# EAGLE design PitchshiftDelay-Control-v1.2 (EAGLE 9.1.3)

## Sheet 1 of 4
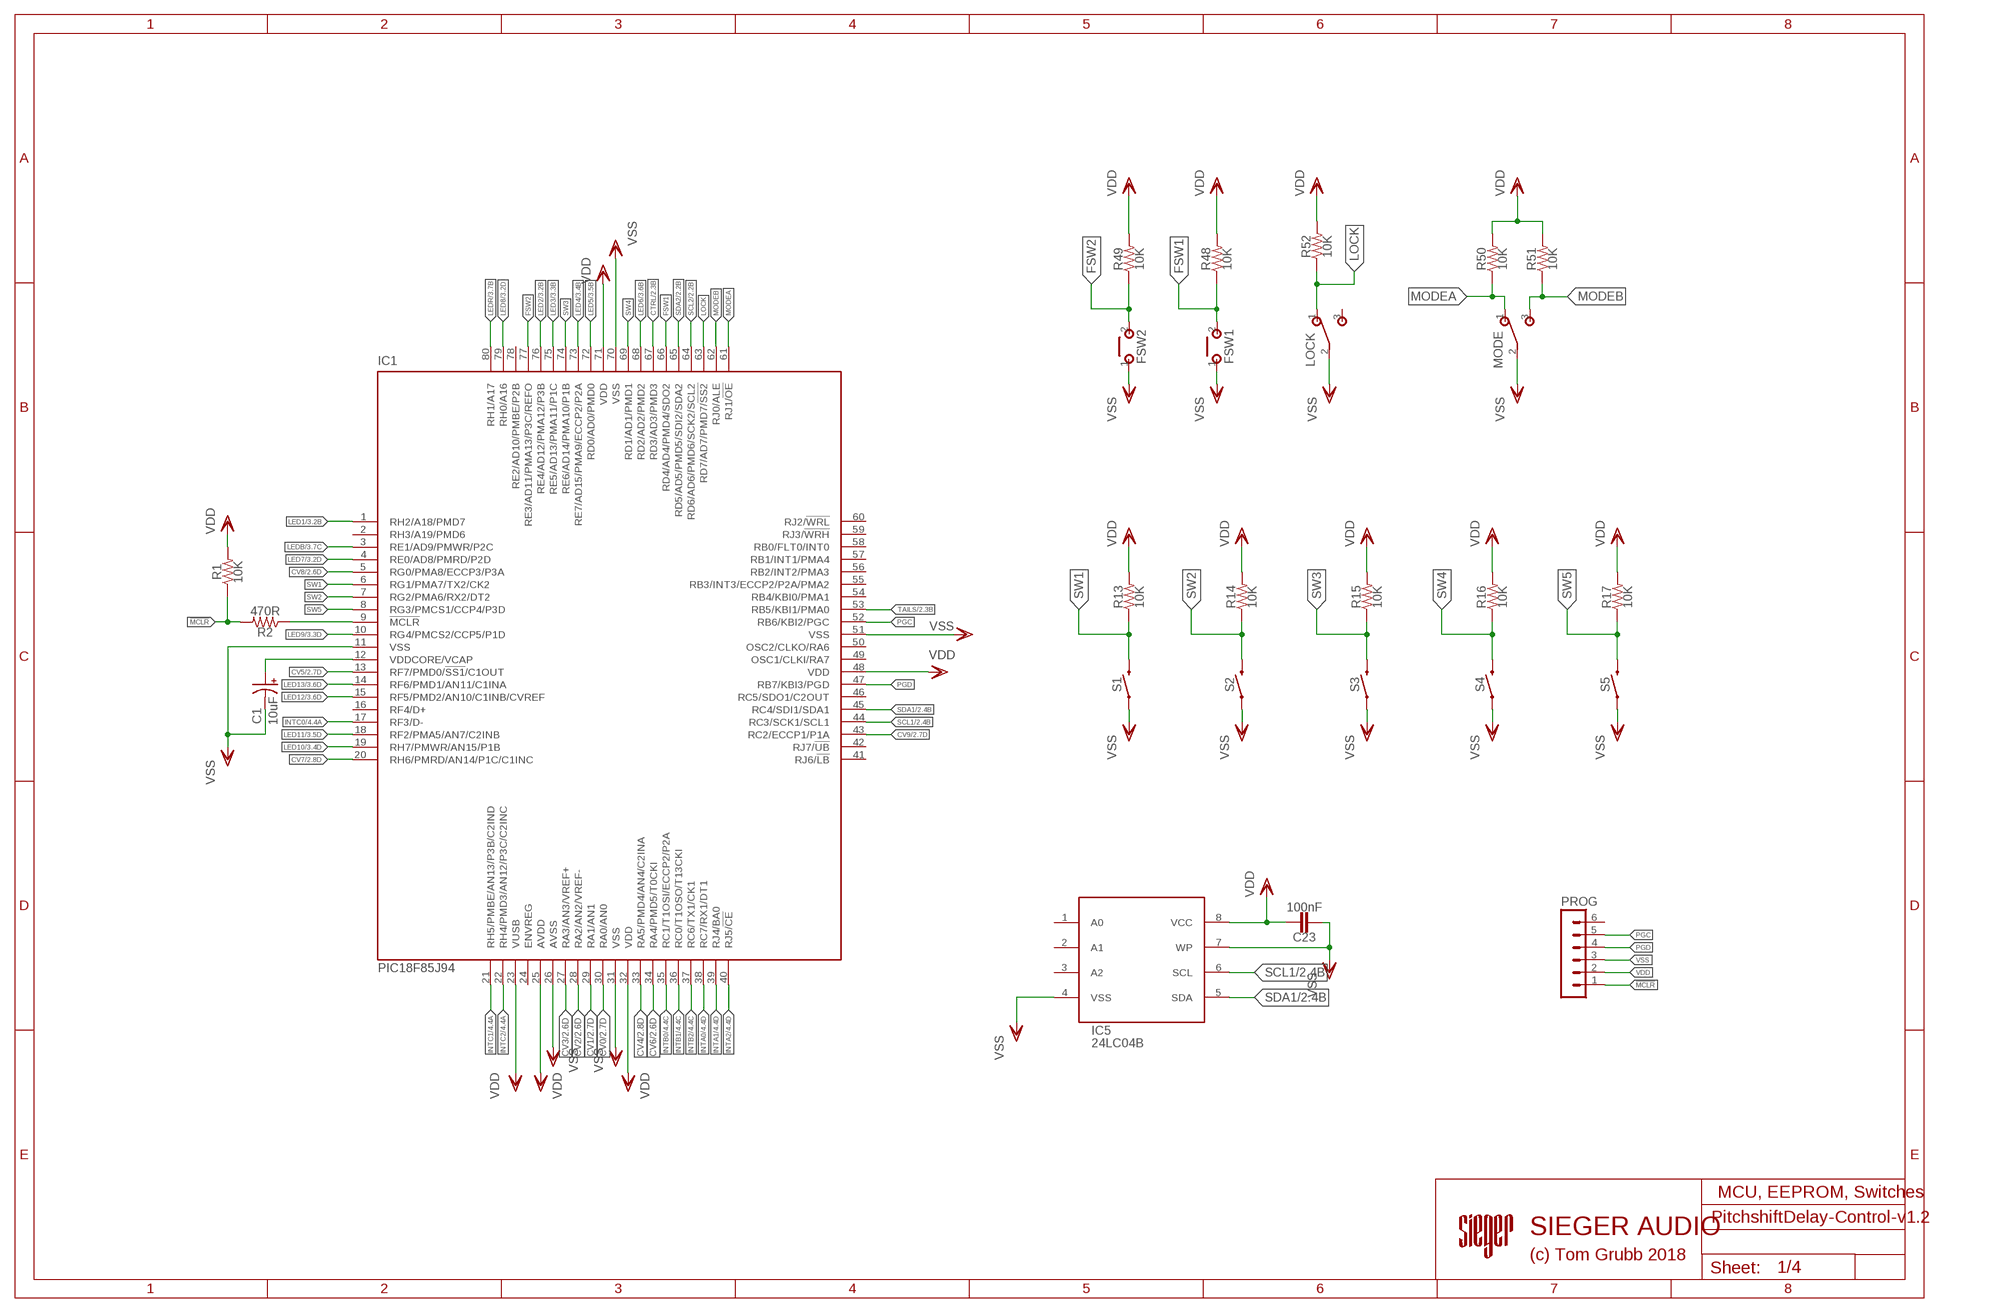
[diagram p0: schematic, sheet 1]

### Parts
C1  10uF  0501  [050_020_1]
C23  100nF  CER/FILM1  [050X030_025]
FSW1  MOMENTARY  [SPST]
FSW2  MOMENTARY  [SPST]
IC1  PIC18F85J94  PIC18F85J50  [TQFP80-12X12]
IC5  24LC04B  [SOIC8]
LOCK  SPDTPIN_MOUNT  [1MS1T1B1C0M2QE]
MODE  SPDTPIN_MOUNT  [1MS1T1B1C0M2QE]
PROG  MA06-1  [MA06-1]
R1  10K  RESISTOR0805  [RESISTOR_C0805]
R2  470R  RESISTOR0805  [RESISTOR_C0805]
R13  10K  RESISTOR0805  [RESISTOR_C0805]
R14  10K  RESISTOR0805  [RESISTOR_C0805]
R15  10K  RESISTOR0805  [RESISTOR_C0805]
R16  10K  RESISTOR0805  [RESISTOR_C0805]
R17  10K  RESISTOR0805  [RESISTOR_C0805]
R48  10K  RESISTOR0805  [RESISTOR_C0805]
R49  10K  RESISTOR0805  [RESISTOR_C0805]
R50  10K  RESISTOR0805  [RESISTOR_C0805]
R51  10K  RESISTOR0805  [RESISTOR_C0805]
R52  10K  RESISTOR0805  [RESISTOR_C0805]
S1  MOMENTARY-SWITCH-SPST-PTH-6.0MM  [TACTILE_SWITCH_PTH_6.0MM]
S2  MOMENTARY-SWITCH-SPST-PTH-6.0MM  [TACTILE_SWITCH_PTH_6.0MM]
S3  MOMENTARY-SWITCH-SPST-PTH-6.0MM  [TACTILE_SWITCH_PTH_6.0MM]
S4  MOMENTARY-SWITCH-SPST-PTH-6.0MM  [TACTILE_SWITCH_PTH_6.0MM]
S5  MOMENTARY-SWITCH-SPST-PTH-6.0MM  [TACTILE_SWITCH_PTH_6.0MM]

### Nets
!MCLR: PROG.1 R1.1 R2.2
CTRL: IC1.67(RD3/AD3/PMD3) ; also sheet 2
CV0: IC1.30(RA0/AN0) ; also sheet 2,4
CV1: IC1.29(RA1/AN1) ; also sheet 2,4
CV2: IC1.28(RA2/AN2/VREF-) ; also sheet 2,4
CV3: IC1.27(RA3/AN3/VREF+) ; also sheet 2,4
CV4: IC1.33(RA5/PMD4/AN4/C2INA) ; also sheet 2,4
CV5: IC1.13(RF7/PMD0/!SS1!/C1OUT) ; also sheet 2,4
CV6: IC1.34(RA4/PMD5/T0CKI) ; also sheet 2,4
CV7: IC1.20(RH6/PMRD/AN14/P1C/C1INC) ; also sheet 2,4
CV8: IC1.5(RG0/PMA8/ECCP3/P3A) ; also sheet 2,4
CV9: IC1.43(RC2/ECCP1/P1A) ; also sheet 2,4
FSW1: FSW1.2(S) IC1.66(RD4/AD4/PMD4/SDO2) R48.1
FSW2: FSW2.2(S) IC1.77(RE3/AD11/PMA13/P3C/REFO) R49.1
INTA0: IC1.38(RC7/RX1/DT1) ; also sheet 4
INTA1: IC1.39(RJ4/BA0) ; also sheet 4
INTA2: IC1.40(RJ5/!CE) ; also sheet 4
INTB0: IC1.35(RC1/T1OSI/ECCP2/P2A) ; also sheet 4
INTB1: IC1.36(RC0/T1OSO/T13CKI) ; also sheet 4
INTB2: IC1.37(RC6/TX1/CK1) ; also sheet 4
INTC0: IC1.17(RF3/D-) ; also sheet 4
INTC1: IC1.21(RH5/PMBE/AN13/P3B/C2IND) ; also sheet 4
INTC2: IC1.22(RH4/PMD3/AN12/P3C/C2INC) ; also sheet 4
LED1: IC1.1(RH2/A18/PMD7) ; also sheet 3
LED2: IC1.76(RE4/AD12/PMA12/P3B) ; also sheet 3
LED3: IC1.75(RE5/AD13/PMA11/P1C) ; also sheet 3
LED4: IC1.73(RE7/AD15/PMA9/ECCP2/P2A) ; also sheet 3
LED5: IC1.72(RD0/AD0/PMD0) ; also sheet 3
LED6: IC1.68(RD2/AD2/PMD2) ; also sheet 3
LED7: IC1.4(RE0/AD8/PMRD/P2D) ; also sheet 3
LED8: IC1.79(RH0/A16) ; also sheet 3
LED9: IC1.10(RG4/PMCS2/CCP5/P1D) ; also sheet 3
LED10: IC1.19(RH7/PMWR/AN15/P1B) ; also sheet 3
LED11: IC1.18(RF2/PMA5/AN7/C2INB) ; also sheet 3
LED12: IC1.15(RF5/PMD2/AN10/C1INB/CVREF) ; also sheet 3
LED13: IC1.14(RF6/PMD1/AN11/C1INA) ; also sheet 3
LEDB: IC1.3(RE1/AD9/PMWR/P2C) ; also sheet 3
LEDR: IC1.80(RH1/A17) ; also sheet 3
LOCK: IC1.63(RD7/AD7/PMD7/!SS2) LOCK.1(O) R52.1
MODEA: IC1.61(RJ1/!OE) MODE.1(O) R50.1
MODEB: IC1.62(RJ0/ALE) MODE.3(S) R51.1
N$1: C1.+ IC1.12(VDDCORE/VCAP)
N$71: IC1.9(!MCLR) R2.1
PGC: IC1.52(RB6/KBI2/PGC) PROG.5
PGD: IC1.47(RB7/KBI3/PGD) PROG.4
SCL1: IC1.44(RC3/SCK1/SCL1) IC5.6(SCL) ; also sheet 2
SCL2: IC1.64(RD6/AD6/PMD6/SCK2/SCL2) ; also sheet 2
SDA1: IC1.45(RC4/SDI1/SDA1) IC5.5(SDA) ; also sheet 2
SDA2: IC1.65(RD5/AD5/PMD5/SDI2/SDA2) ; also sheet 2
SW1: IC1.6(RG1/PMA7/TX2/CK2) R13.1 S1.3
SW2: IC1.7(RG2/PMA6/RX2/DT2) R14.1 S2.3
SW3: IC1.74(RE6/AD14/PMA10/P1B) R15.1 S3.3
SW4: IC1.69(RD1/AD1/PMD1) R16.1 S4.3
SW5: IC1.8(RG3/PMCS1/CCP4/P3D) R17.1 S5.3
TAILS: IC1.53(RB5/KBI1/PMA0) ; also sheet 2
VDD: C23.1 IC1.23(VUSB) IC1.25(AVDD) IC1.32(VDD) IC1.48(VDD) IC1.71(VDD) IC5.8(VCC) PROG.2 R1.2 R13.2 R14.2 R15.2 R16.2 R17.2 R48.2 R49.2 R50.2 R51.2 R52.2 ; also sheet 2,3,4
VSS: C1.- C23.2 FSW1.1(P) FSW2.1(P) IC1.11(VSS) IC1.26(AVSS) IC1.31(VSS) IC1.51(VSS) IC1.70(VSS) IC5.4(VSS) IC5.7(WP) LOCK.2(P) MODE.2(P) PROG.3 S1.1 S2.1 S3.1 S4.1 S5.1 ; also sheet 2,3,4
Unconnected: IC1.2(RH3/A19/PMD6) IC1.16(RF4/D+) IC1.24(ENVREG) IC1.41(RJ6/!LB) IC1.42(RJ7/!UB) IC1.46(RC5/SDO1/C2OUT) IC1.49(OSC1/CLKI/RA7) IC1.50(OSC2/CLKO/RA6) IC1.54(RB4/KBI0/PMA1) IC1.55(RB3/INT3/ECCP2/P2A/PMA2) IC1.56(RB2/INT2/PMA3) IC1.57(RB1/INT1/PMA4) IC1.58(RB0/FLT0/INT0) IC1.59(RJ3/!WRH) IC1.60(RJ2/!WRL) IC1.78(RE2/AD10/PMBE/P2B) IC5.1(A0) IC5.2(A1) IC5.3(A2) LOCK.3(S) PROG.6

### Notes on the sheet
- MCU, EEPROM, Switches
- SIEGER AUDIO
- (c) Tom Grubb 2018

## Sheet 2 of 4
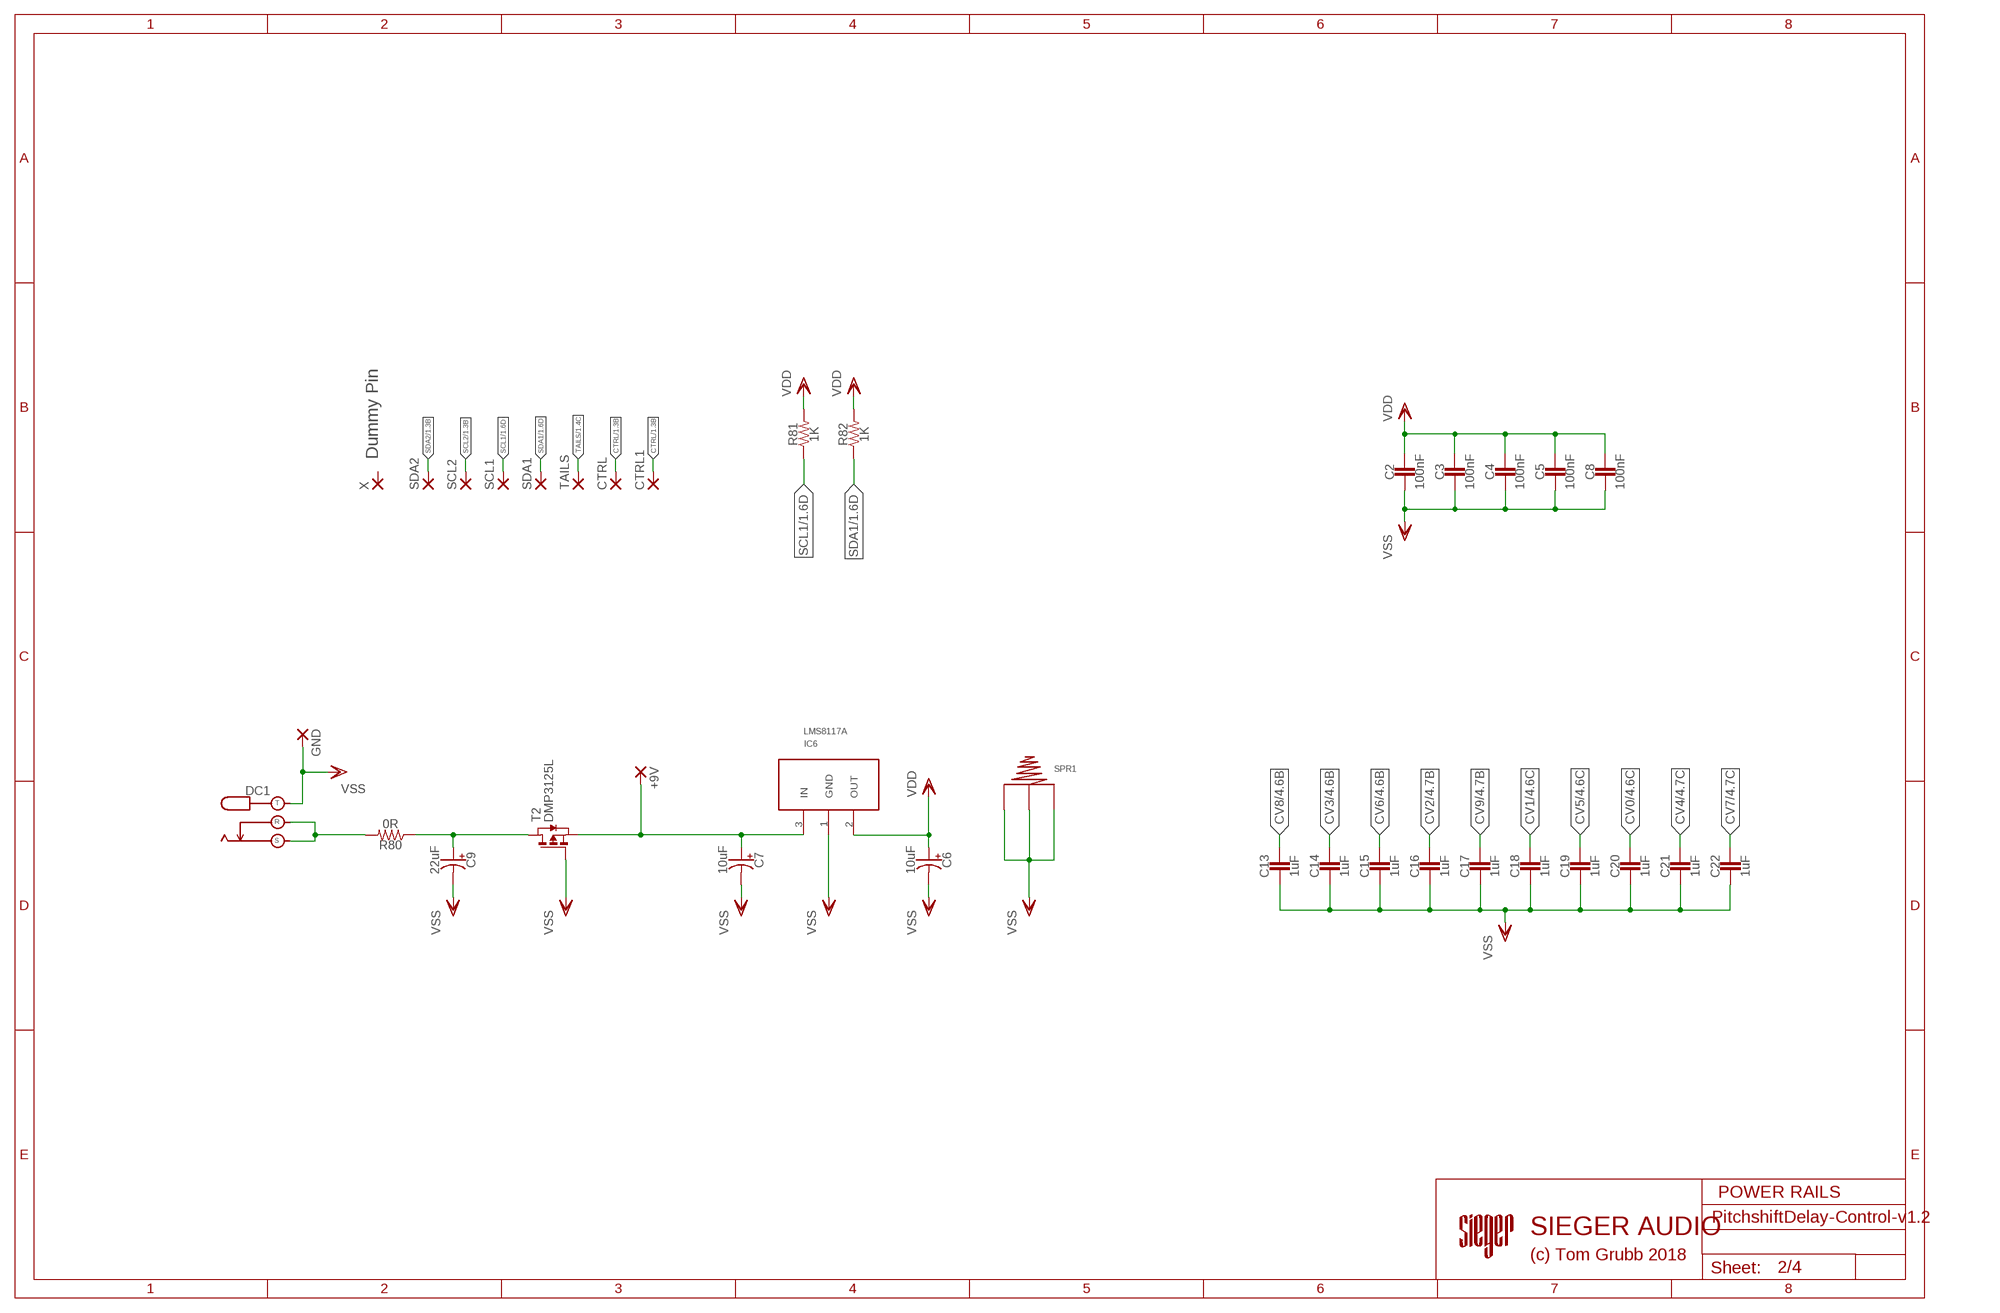
[diagram p1: schematic, sheet 2]

### Parts
+9V  2,15/1,0  [2,15/1,0]
C2  100nF  CER/FILM1  [050X030_025]
C3  100nF  CER/FILM1  [050X030_025]
C4  100nF  CER/FILM1  [050X030_025]
C5  100nF  CER/FILM1  [050X030_025]
C6  10uF  0501  [050_020_1]
C7  10uF  0501  [050_020_1]
C8  100nF  CER/FILM1  [050X030_025]
C9  22uF  0501  [050_020_1]
C13  1uF  CER/FILM1  [050X030_025]
C14  1uF  CER/FILM1  [050X030_025]
C15  1uF  CER/FILM1  [050X030_025]
C16  1uF  CER/FILM1  [050X030_025]
C17  1uF  CER/FILM1  [050X030_025]
C18  1uF  CER/FILM1  [050X030_025]
C19  1uF  CER/FILM1  [050X030_025]
C20  1uF  CER/FILM1  [050X030_025]
C21  1uF  CER/FILM1  [050X030_025]
C22  1uF  CER/FILM1  [050X030_025]
CTRL  2,15/1,0  [2,15/1,0]
CTRL1  2,15/1,0  [2,15/1,0]
DC1  DC_KOBICONN  [DC_KOBICONN]
GND  2,15/1,0  [2,15/1,0]
IC6  LMS8117A  [SOT223]
R80  0R  RESISTOR0805  [RESISTOR_C0805]
R81  1K  RESISTOR0805  [RESISTOR_C0805]
R82  1K  RESISTOR0805  [RESISTOR_C0805]
SCL1  2,15/1,0  [2,15/1,0]
SCL2  2,15/1,0  [2,15/1,0]
SDA1  2,15/1,0  [2,15/1,0]
SDA2  2,15/1,0  [2,15/1,0]
SPR1  534-628  SPRING  ['A'SIZE-PC-SPRING]
T2  DMP3125L  PMOSSOT23  [SOT-23]
TAILS  2,15/1,0  [2,15/1,0]
X  2,15/1,0  [2,15/1,0]

### Nets
9V: +9V.1(P) C7.+ IC6.3(IN) T2.2(S)
CTRL: CTRL1.1(P) CTRL.1(P) ; also sheet 1
CV0: C20.1 ; also sheet 1,4
CV1: C18.1 ; also sheet 1,4
CV2: C16.1 ; also sheet 1,4
CV3: C14.1 ; also sheet 1,4
CV4: C21.1 ; also sheet 1,4
CV5: C19.1 ; also sheet 1,4
CV6: C15.1 ; also sheet 1,4
CV7: C22.1 ; also sheet 1,4
CV8: C13.1 ; also sheet 1,4
CV9: C17.1 ; also sheet 1,4
SCL1: R81.1 SCL1.1(P) ; also sheet 1
SCL2: SCL2.1(P) ; also sheet 1
SDA1: R82.1 SDA1.1(P) ; also sheet 1
SDA2: SDA2.1(P) ; also sheet 1
TAILS: TAILS.1(P) ; also sheet 1
VDD: C2.1 C3.1 C4.1 C5.1 C6.+ C8.1 IC6.2(OUT) R81.2 R82.2 ; also sheet 1,3,4
VIN: DC1.R DC1.S R80.2
VINF: C9.+ R80.1 T2.1(D)
VSS: C2.2 C3.2 C4.2 C5.2 C6.- C7.- C8.2 C9.- C13.2 C14.2 C15.2 C16.2 C17.2 C18.2 C19.2 C20.2 C21.2 C22.2 DC1.T GND.1(P) IC6.1(GND) SPR1.P$1 SPR1.P$2 SPR1.P$3 T2.3(G) ; also sheet 1,3,4
Unconnected: X.1(P)

### Notes on the sheet
- Dummy Pin
- POWER RAILS
- SIEGER AUDIO
- (c) Tom Grubb 2018

## Sheet 3 of 4
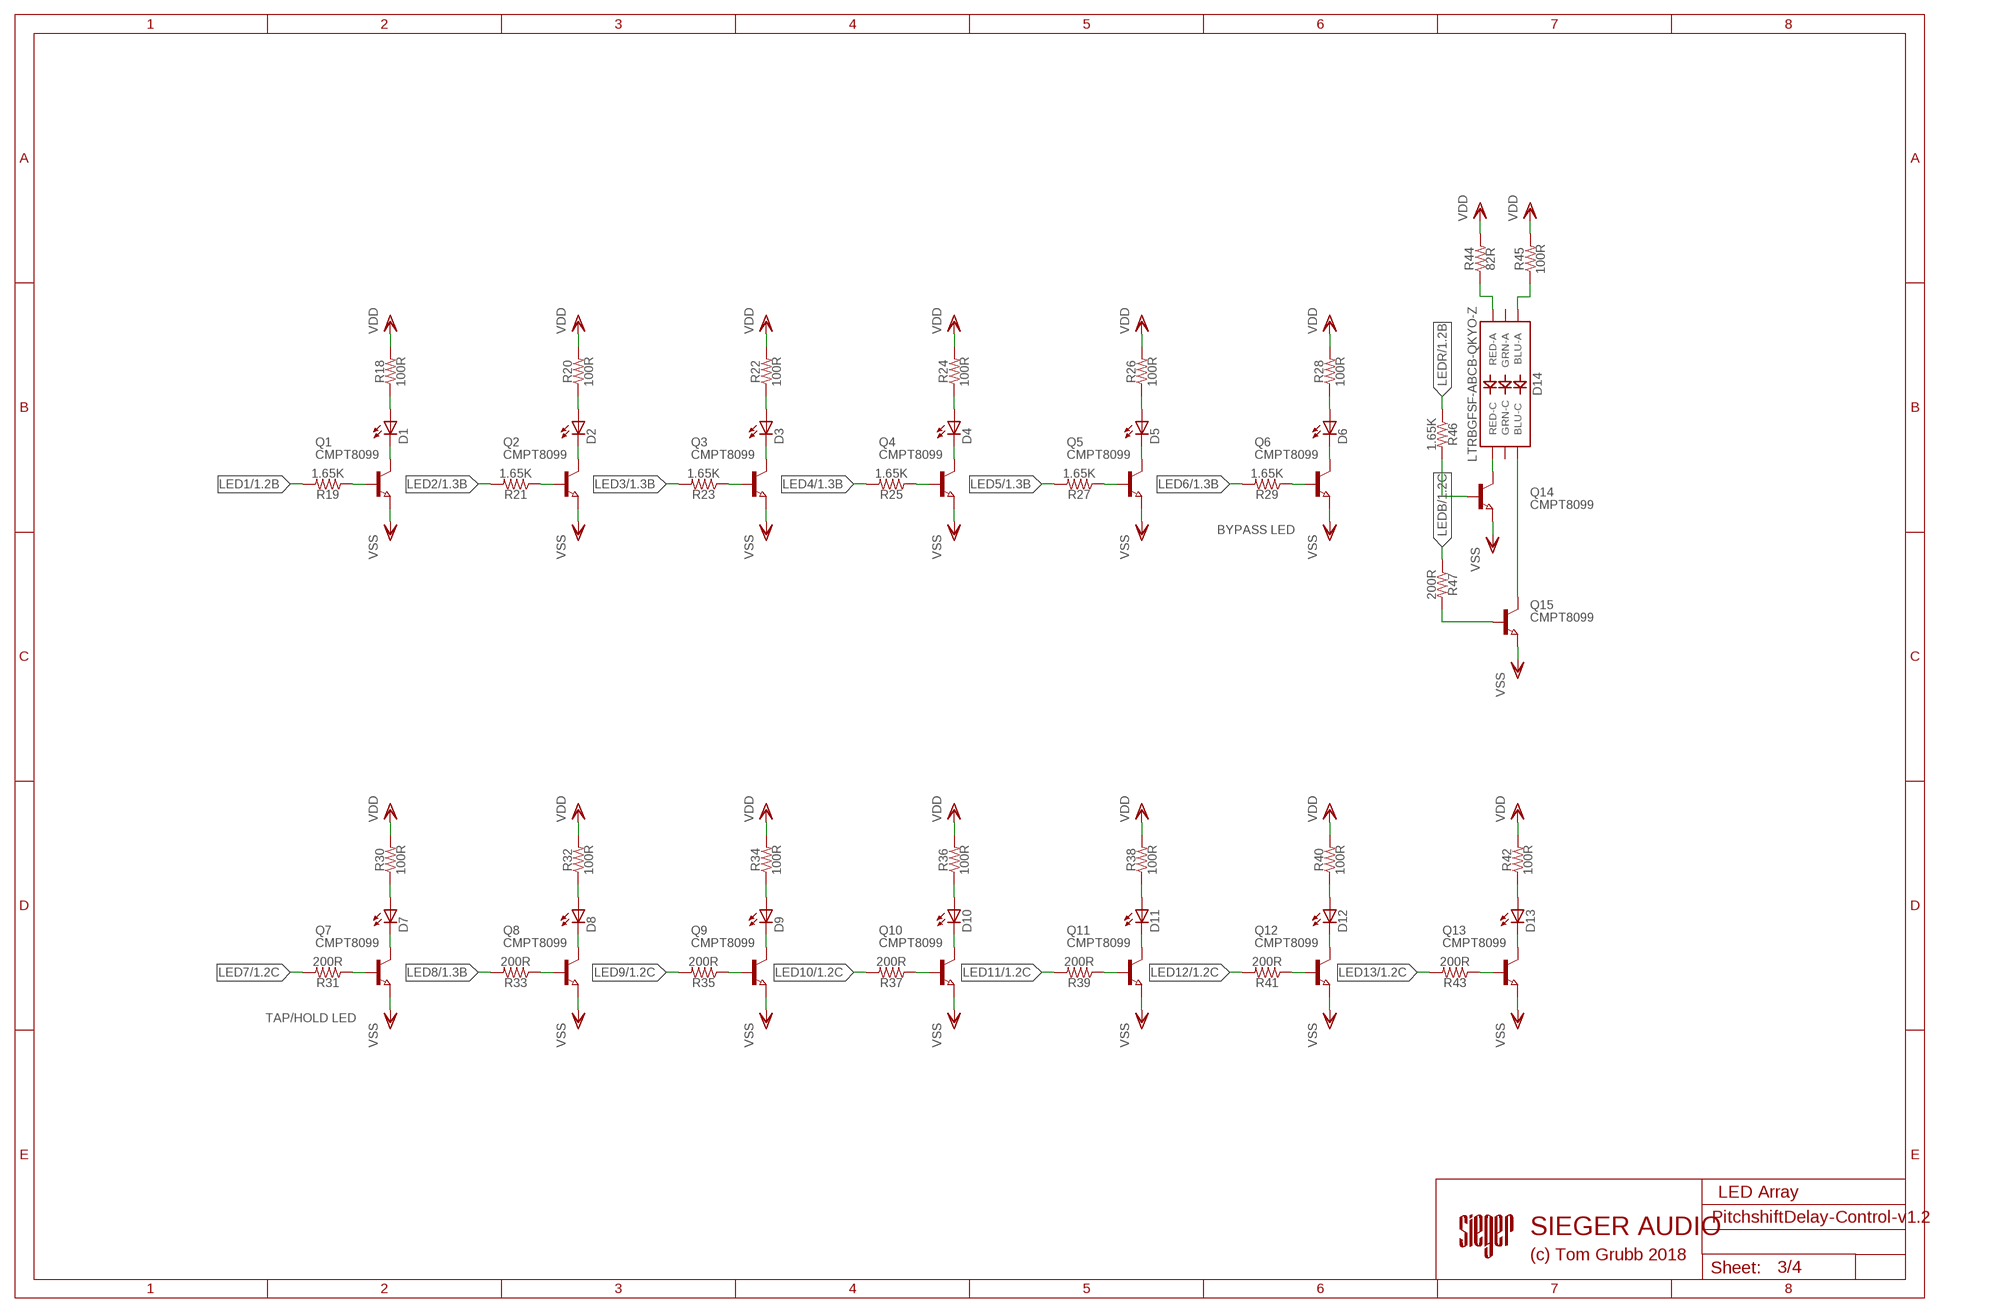
[diagram p2: schematic, sheet 3]

### Parts
D1  LEDCHIP-LED0805  [CHIP-LED0805]
D2  LEDCHIP-LED0805  [CHIP-LED0805]
D3  LEDCHIP-LED0805  [CHIP-LED0805]
D4  LEDCHIP-LED0805  [CHIP-LED0805]
D5  LEDCHIP-LED0805  [CHIP-LED0805]
D6  LEDCHIPLED_1206  [CHIPLED_1206]
D7  LEDCHIPLED_1206  [CHIPLED_1206]
D8  LEDCHIP-LED0805  [CHIP-LED0805]
D9  LEDCHIP-LED0805  [CHIP-LED0805]
D10  LEDCHIP-LED0805  [CHIP-LED0805]
D11  LEDCHIP-LED0805  [CHIP-LED0805]
D12  LEDCHIP-LED0805  [CHIP-LED0805]
D13  LEDCHIP-LED0805  [CHIP-LED0805]
D14  LTRBGFSF-ABCB-QKYO-Z  LED-RGBPLCC-6  [PLCC-6-LED]
Q1  CMPT8099  NPN-TRANSISTOR_SOT23  [SOT23]
Q2  CMPT8099  NPN-TRANSISTOR_SOT23  [SOT23]
Q3  CMPT8099  NPN-TRANSISTOR_SOT23  [SOT23]
Q4  CMPT8099  NPN-TRANSISTOR_SOT23  [SOT23]
Q5  CMPT8099  NPN-TRANSISTOR_SOT23  [SOT23]
Q6  CMPT8099  NPN-TRANSISTOR_SOT23  [SOT23]
Q7  CMPT8099  NPN-TRANSISTOR_SOT23  [SOT23]
Q8  CMPT8099  NPN-TRANSISTOR_SOT23  [SOT23]
Q9  CMPT8099  NPN-TRANSISTOR_SOT23  [SOT23]
Q10  CMPT8099  NPN-TRANSISTOR_SOT23  [SOT23]
Q11  CMPT8099  NPN-TRANSISTOR_SOT23  [SOT23]
Q12  CMPT8099  NPN-TRANSISTOR_SOT23  [SOT23]
Q13  CMPT8099  NPN-TRANSISTOR_SOT23  [SOT23]
Q14  CMPT8099  NPN-TRANSISTOR_SOT23  [SOT23]
Q15  CMPT8099  NPN-TRANSISTOR_SOT23  [SOT23]
R18  100R  RESISTOR0805  [RESISTOR_C0805]
R19  1.65K  RESISTOR0805  [RESISTOR_C0805]
R20  100R  RESISTOR0805  [RESISTOR_C0805]
R21  1.65K  RESISTOR0805  [RESISTOR_C0805]
R22  100R  RESISTOR0805  [RESISTOR_C0805]
R23  1.65K  RESISTOR0805  [RESISTOR_C0805]
R24  100R  RESISTOR0805  [RESISTOR_C0805]
R25  1.65K  RESISTOR0805  [RESISTOR_C0805]
R26  100R  RESISTOR0805  [RESISTOR_C0805]
R27  1.65K  RESISTOR0805  [RESISTOR_C0805]
R28  100R  RESISTOR0805  [RESISTOR_C0805]
R29  1.65K  RESISTOR0805  [RESISTOR_C0805]
R30  100R  RESISTOR0805  [RESISTOR_C0805]
R31  200R  RESISTOR0805  [RESISTOR_C0805]
R32  100R  RESISTOR0805  [RESISTOR_C0805]
R33  200R  RESISTOR0805  [RESISTOR_C0805]
R34  100R  RESISTOR0805  [RESISTOR_C0805]
R35  200R  RESISTOR0805  [RESISTOR_C0805]
R36  100R  RESISTOR0805  [RESISTOR_C0805]
R37  200R  RESISTOR0805  [RESISTOR_C0805]
R38  100R  RESISTOR0805  [RESISTOR_C0805]
R39  200R  RESISTOR0805  [RESISTOR_C0805]
R40  100R  RESISTOR0805  [RESISTOR_C0805]
R41  200R  RESISTOR0805  [RESISTOR_C0805]
R42  100R  RESISTOR0805  [RESISTOR_C0805]
R43  200R  RESISTOR0805  [RESISTOR_C0805]
R44  82R  RESISTOR0805  [RESISTOR_C0805]
R45  100R  RESISTOR0805  [RESISTOR_C0805]
R46  1.65K  RESISTOR0805  [RESISTOR_C0805]
R47  200R  RESISTOR0805  [RESISTOR_C0805]

### Nets
LED1: R19.2 ; also sheet 1
LED2: R21.2 ; also sheet 1
LED3: R23.2 ; also sheet 1
LED4: R25.2 ; also sheet 1
LED5: R27.2 ; also sheet 1
LED6: R29.2 ; also sheet 1
LED7: R31.2 ; also sheet 1
LED8: R33.2 ; also sheet 1
LED9: R35.2 ; also sheet 1
LED10: R37.2 ; also sheet 1
LED11: R39.2 ; also sheet 1
LED12: R41.2 ; also sheet 1
LED13: R43.2 ; also sheet 1
LEDB: R47.1 ; also sheet 1
LEDR: R46.1 ; also sheet 1
N$12: D1.C Q1.3(C)
N$13: D1.A R18.1
N$14: Q2.1(B) R21.1
N$15: D2.C Q2.3(C)
N$16: D2.A R20.1
N$17: Q1.1(B) R19.1
N$18: Q3.1(B) R23.1
N$19: D3.C Q3.3(C)
N$20: D3.A R22.1
N$21: Q4.1(B) R25.1
N$22: D4.C Q4.3(C)
N$23: D4.A R24.1
N$24: Q5.1(B) R27.1
N$25: D5.C Q5.3(C)
N$26: D5.A R26.1
N$27: Q6.1(B) R29.1
N$28: D6.C Q6.3(C)
N$29: D6.A R28.1
N$30: Q7.1(B) R31.1
N$31: D7.C Q7.3(C)
N$32: D7.A R30.1
N$33: Q8.1(B) R33.1
N$34: D8.C Q8.3(C)
N$35: D8.A R32.1
N$36: Q9.1(B) R35.1
N$37: D9.C Q9.3(C)
N$38: D9.A R34.1
N$39: Q10.1(B) R37.1
N$40: D10.C Q10.3(C)
N$41: D10.A R36.1
N$42: Q11.1(B) R39.1
N$43: D11.C Q11.3(C)
N$44: D11.A R38.1
N$45: Q12.1(B) R41.1
N$46: D12.C Q12.3(C)
N$47: D12.A R40.1
N$48: Q13.1(B) R43.1
N$49: D13.C Q13.3(C)
N$50: D13.A R42.1
N$51: D14.AR(RED-A) R44.1
N$52: D14.AB(BLU-A) R45.1
N$53: D14.CR(RED-C) Q14.3(C)
N$54: D14.CB(BLU-C) Q15.3(C)
N$56: Q14.1(B) R46.2
N$58: Q15.1(B) R47.2
VDD: R18.2 R20.2 R22.2 R24.2 R26.2 R28.2 R30.2 R32.2 R34.2 R36.2 R38.2 R40.2 R42.2 R44.2 R45.2 ; also sheet 1,2,4
VSS: Q1.2(E) Q2.2(E) Q3.2(E) Q4.2(E) Q5.2(E) Q6.2(E) Q7.2(E) Q8.2(E) Q9.2(E) Q10.2(E) Q11.2(E) Q12.2(E) Q13.2(E) Q14.2(E) Q15.2(E) ; also sheet 1,2,4
Unconnected: D14.AG(GRN-A) D14.CG(GRN-C)

### Notes on the sheet
- BYPASS LED
- TAP/HOLD LED
- LED Array
- SIEGER AUDIO
- (c) Tom Grubb 2018

## Sheet 4 of 4
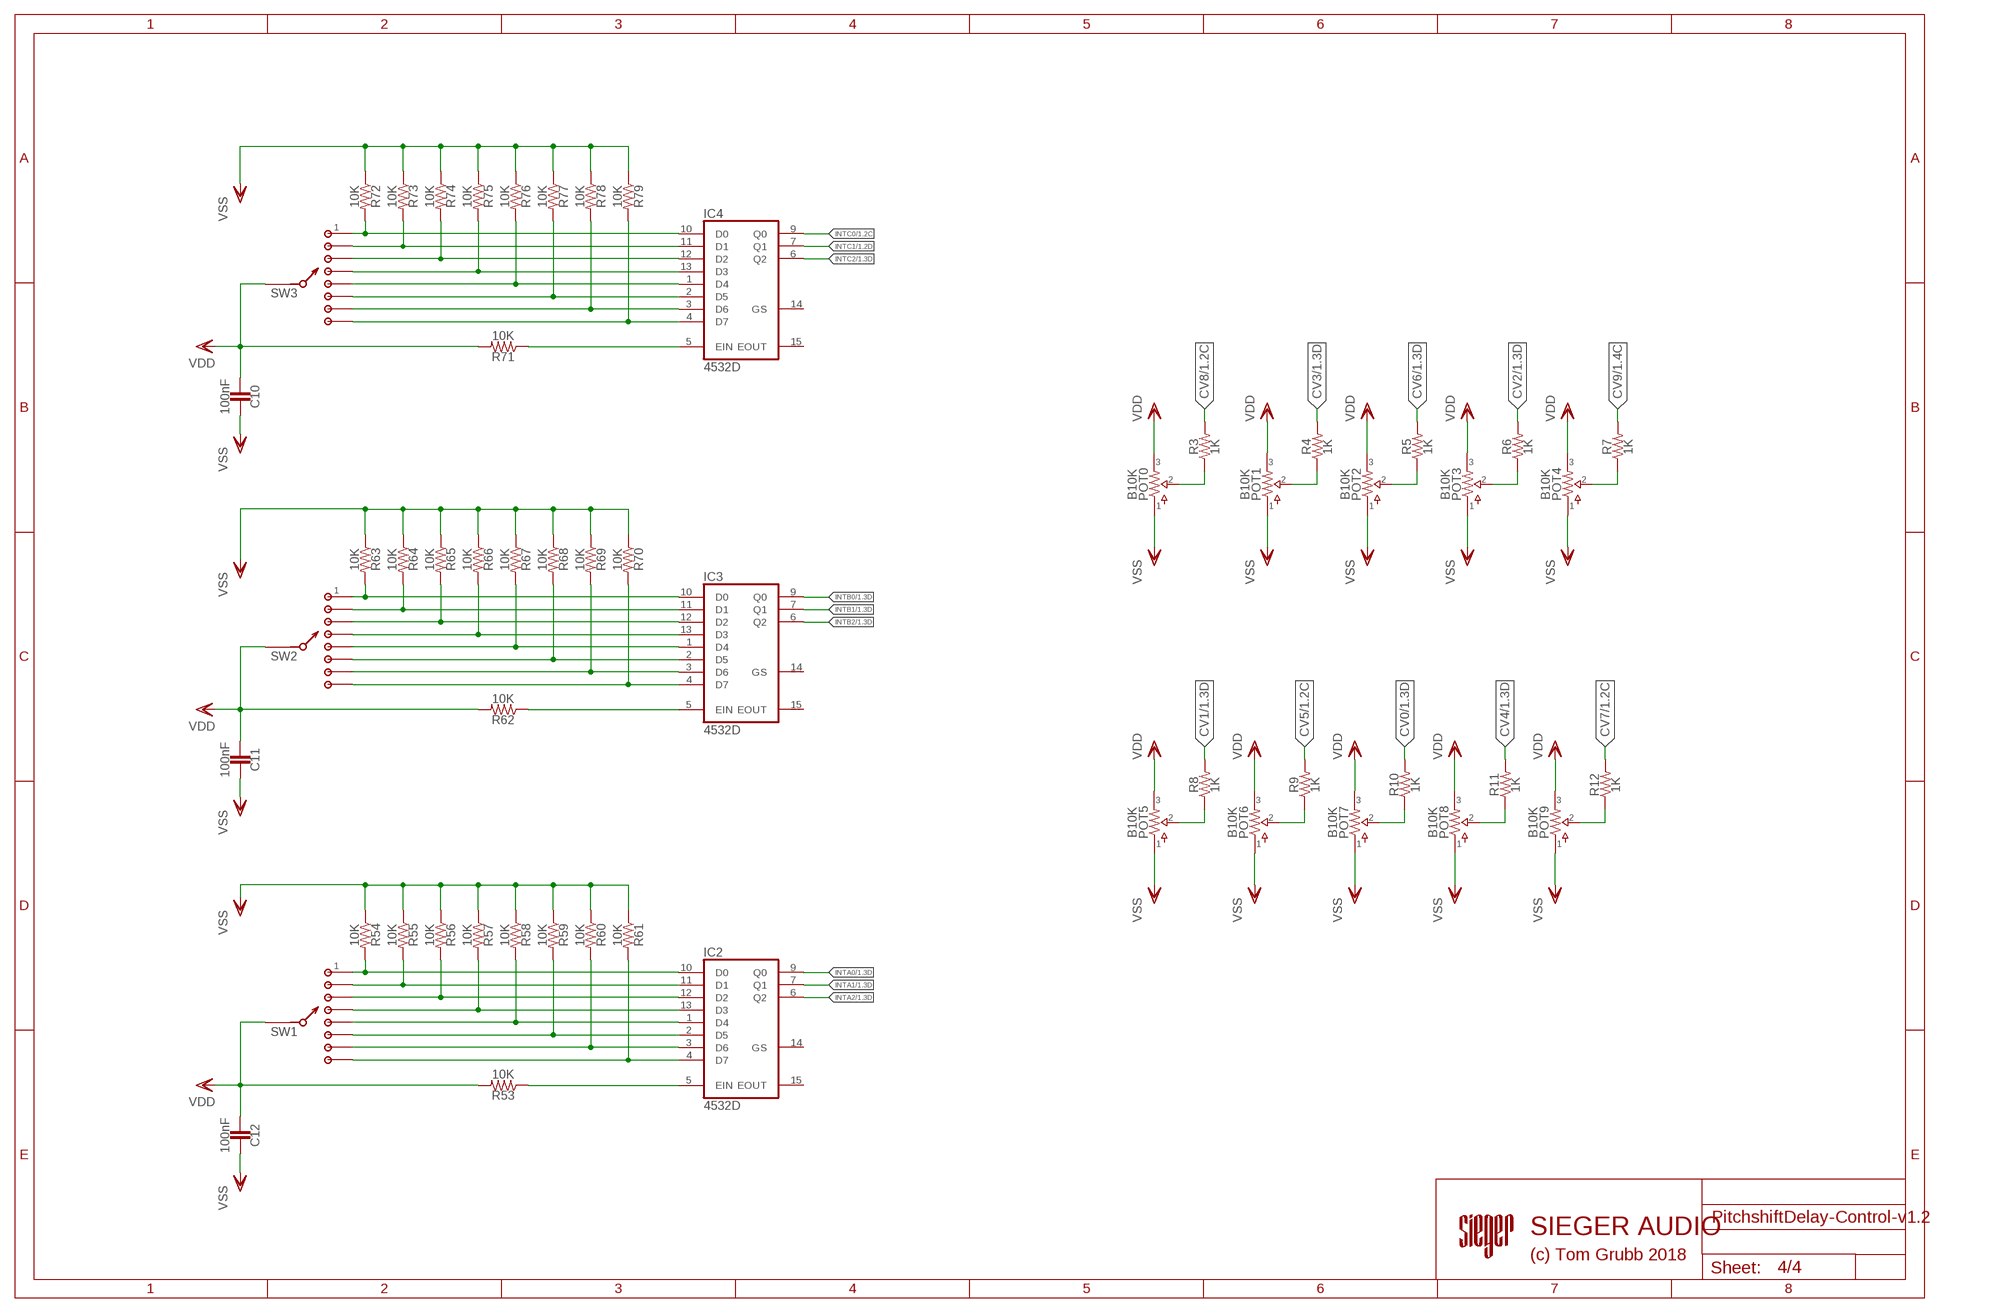
[diagram p3: schematic, sheet 4]

### Parts
C10  100nF  CER/FILM1  [050X030_025]
C11  100nF  CER/FILM1  [050X030_025]
C12  100nF  CER/FILM1  [050X030_025]
IC2  4532D  [SO16]
IC3  4532D  [SO16]
IC4  4532D  [SO16]
POT0  B10K  POTS9MM_MOUNTED_2MMH  [9MM_W/MOUNTS-2MMHOLES]
POT1  B10K  POTS9MM_MOUNTED_2MMH  [9MM_W/MOUNTS-2MMHOLES]
POT2  B10K  POTS9MM_MOUNTED_2MMH  [9MM_W/MOUNTS-2MMHOLES]
POT3  B10K  POTS9MM_MOUNTED_2MMH  [9MM_W/MOUNTS-2MMHOLES]
POT4  B10K  POTS9MM_MOUNTED_2MMH  [9MM_W/MOUNTS-2MMHOLES]
POT5  B10K  POTS9MM_MOUNTED_2MMH  [9MM_W/MOUNTS-2MMHOLES]
POT6  B10K  POTS9MM_MOUNTED_2MMH  [9MM_W/MOUNTS-2MMHOLES]
POT7  B10K  POTS9MM_MOUNTED_2MMH  [9MM_W/MOUNTS-2MMHOLES]
POT8  B10K  POTS9MM_MOUNTED_2MMH  [9MM_W/MOUNTS-2MMHOLES]
POT9  B10K  POTS9MM_MOUNTED_2MMH  [9MM_W/MOUNTS-2MMHOLES]
R3  1K  RESISTOR0805  [RESISTOR_C0805]
R4  1K  RESISTOR0805  [RESISTOR_C0805]
R5  1K  RESISTOR0805  [RESISTOR_C0805]
R6  1K  RESISTOR0805  [RESISTOR_C0805]
R7  1K  RESISTOR0805  [RESISTOR_C0805]
R8  1K  RESISTOR0805  [RESISTOR_C0805]
R9  1K  RESISTOR0805  [RESISTOR_C0805]
R10  1K  RESISTOR0805  [RESISTOR_C0805]
R11  1K  RESISTOR0805  [RESISTOR_C0805]
R12  1K  RESISTOR0805  [RESISTOR_C0805]
R53  10K  RESISTOR0805  [RESISTOR_C0805]
R54  10K  RESISTOR0805  [RESISTOR_C0805]
R55  10K  RESISTOR0805  [RESISTOR_C0805]
R56  10K  RESISTOR0805  [RESISTOR_C0805]
R57  10K  RESISTOR0805  [RESISTOR_C0805]
R58  10K  RESISTOR0805  [RESISTOR_C0805]
R59  10K  RESISTOR0805  [RESISTOR_C0805]
R60  10K  RESISTOR0805  [RESISTOR_C0805]
R61  10K  RESISTOR0805  [RESISTOR_C0805]
R62  10K  RESISTOR0805  [RESISTOR_C0805]
R63  10K  RESISTOR0805  [RESISTOR_C0805]
R64  10K  RESISTOR0805  [RESISTOR_C0805]
R65  10K  RESISTOR0805  [RESISTOR_C0805]
R66  10K  RESISTOR0805  [RESISTOR_C0805]
R67  10K  RESISTOR0805  [RESISTOR_C0805]
R68  10K  RESISTOR0805  [RESISTOR_C0805]
R69  10K  RESISTOR0805  [RESISTOR_C0805]
R70  10K  RESISTOR0805  [RESISTOR_C0805]
R71  10K  RESISTOR0805  [RESISTOR_C0805]
R72  10K  RESISTOR0805  [RESISTOR_C0805]
R73  10K  RESISTOR0805  [RESISTOR_C0805]
R74  10K  RESISTOR0805  [RESISTOR_C0805]
R75  10K  RESISTOR0805  [RESISTOR_C0805]
R76  10K  RESISTOR0805  [RESISTOR_C0805]
R77  10K  RESISTOR0805  [RESISTOR_C0805]
R78  10K  RESISTOR0805  [RESISTOR_C0805]
R79  10K  RESISTOR0805  [RESISTOR_C0805]
SW1  1P8T  [SMALLROTARY]
SW2  1P8T  [SMALLROTARY]
SW3  1P8T  [SMALLROTARY]

### Nets
CV0: R10.2 ; also sheet 1,2
CV1: R8.2 ; also sheet 1,2
CV2: R6.2 ; also sheet 1,2
CV3: R4.2 ; also sheet 1,2
CV4: R11.2 ; also sheet 1,2
CV5: R9.2 ; also sheet 1,2
CV6: R5.2 ; also sheet 1,2
CV7: R12.2 ; also sheet 1,2
CV8: R3.2 ; also sheet 1,2
CV9: R7.2 ; also sheet 1,2
INTA0: IC2.9(Q0) ; also sheet 1
INTA1: IC2.7(Q1) ; also sheet 1
INTA2: IC2.6(Q2) ; also sheet 1
INTB0: IC3.9(Q0) ; also sheet 1
INTB1: IC3.7(Q1) ; also sheet 1
INTB2: IC3.6(Q2) ; also sheet 1
INTC0: IC4.9(Q0) ; also sheet 1
INTC1: IC4.7(Q1) ; also sheet 1
INTC2: IC4.6(Q2) ; also sheet 1
N$2: POT0.P$2 R3.1
N$3: POT1.P$2 R4.1
N$4: POT2.P$2 R5.1
N$5: POT3.P$2 R6.1
N$6: POT4.P$2 R7.1
N$7: POT5.P$2 R8.1
N$8: POT6.P$2 R9.1
N$9: POT7.P$2 R10.1
N$10: POT8.P$2 R11.1
N$11: POT9.P$2 R12.1
N$55: IC2.5(EIN) R53.1
N$57: IC3.10(D0) R63.2 SW2.1
N$59: IC3.11(D1) R64.2 SW2.2
N$60: IC3.12(D2) R65.2 SW2.3
N$61: IC3.13(D3) R66.2 SW2.4
N$62: IC2.10(D0) R54.2 SW1.1
N$63: IC2.11(D1) R55.2 SW1.2
N$64: IC2.12(D2) R56.2 SW1.3
N$65: IC2.13(D3) R57.2 SW1.4
N$66: IC2.1(D4) R58.2 SW1.5
N$67: IC2.2(D5) R59.2 SW1.6
N$68: IC2.3(D6) R60.2 SW1.7
N$69: IC2.4(D7) R61.2 SW1.8
N$70: IC3.1(D4) R67.2 SW2.5
N$72: IC3.2(D5) R68.2 SW2.6
N$73: IC3.3(D6) R69.2 SW2.7
N$74: IC3.4(D7) R70.2 SW2.8
N$75: IC3.5(EIN) R62.1
N$76: IC4.10(D0) R72.2 SW3.1
N$77: IC4.11(D1) R73.2 SW3.2
N$78: IC4.12(D2) R74.2 SW3.3
N$79: IC4.13(D3) R75.2 SW3.4
N$80: IC4.1(D4) R76.2 SW3.5
N$81: IC4.2(D5) R77.2 SW3.6
N$82: IC4.3(D6) R78.2 SW3.7
N$83: IC4.4(D7) R79.2 SW3.8
N$84: IC4.5(EIN) R71.1
VDD: C10.2 C11.2 C12.2 POT0.P$3 POT1.P$3 POT2.P$3 POT3.P$3 POT4.P$3 POT5.P$3 POT6.P$3 POT7.P$3 POT8.P$3 POT9.P$3 R53.2 R62.2 R71.2 SW1.C(A) SW2.C(A) SW3.C(A) ; also sheet 1,2,3
VSS: C10.1 C11.1 C12.1 POT0.P$1 POT1.P$1 POT2.P$1 POT3.P$1 POT4.P$1 POT5.P$1 POT6.P$1 POT7.P$1 POT8.P$1 POT9.P$1 R54.1 R55.1 R56.1 R57.1 R58.1 R59.1 R60.1 R61.1 R63.1 R64.1 R65.1 R66.1 R67.1 R68.1 R69.1 R70.1 R72.1 R73.1 R74.1 R75.1 R76.1 R77.1 R78.1 R79.1 ; also sheet 1,2,3
Unconnected: IC2.14(GS) IC2.15(EOUT) IC3.14(GS) IC3.15(EOUT) IC4.14(GS) IC4.15(EOUT)

### Notes on the sheet
- SIEGER AUDIO
- (c) Tom Grubb 2018

## Power pins joined to a net without a drawn wire
VDD: IC2.16(VDD) IC3.16(VDD) IC4.16(VDD)
VSS: IC2.8(VSS) IC3.8(VSS) IC4.8(VSS)

## Library data of the parts
+9V CTRL CTRL1 GND SCL1 SCL2 SDA1 SDA2 TAILS X = wirepad:2,15/1,0: THROUGH-HOLE PAD
C1 C6 C7 C9 = MBP_capacitors-elec:050: 0.22 - 100uF Xicon values at Mouser.com: 10V: 10 - 100uF; 16V: 2.2 - 47uF; 25V: 0.47 - 47uF; 50V: 0.22 - 22uF
C2-C5 C8 C10-C23 = MBP_capacitors-film:CER/FILM: 47 - 120pF Xicon Ceramic Disc 2.5mm lead spacing
D1-D13 = led:LED: LED OSRAM: - CHIPLED LG R971, LG N971, LY N971, LG Q971, LY Q971, LO R971, LY R971 LH N974, LH R974 LS Q976, LO Q976, LY Q976 LO Q996 - Hyper CHIPLED LW Q18S LB Q993, LB Q99A, LB R99A - SideLED LS A670, LO A670, LY A670, LG A670, LP A670 LB A673, LV A673, LT A673, LW A673 LH A674 LY A675 LS A676, LA A676, LO A676, LY A676, LW A676 LS A679, LY A679, LG A679 - Hyper Micro SIDELED® LS Y876, LA Y876, LO Y876, LY Y876 LT Y87S - SmartLED LW L88C, LW L88S LB L89C, LB L89S, LG L890 LS L89K, LO L89K, LY L89K LS L896, LA L896, LO L896, LY L896 - TOPLED LS T670, LO T670, LY T670, LG T670, LP T670 LSG T670, LSP T670, LSY T670, LOP T670, LYG T670 LG T671, LOG T671, LSG T671 LB T673, LV T673, LT T673, LW T673 LH T674 LS T676, LA T676, LO T676, LY T676, LB T676, LH T676, LSB T676, LW T676 LB T67C, LV T67C, LT T67C, LS T67K, LO T67K, LY T67K, LW E67C LS E67B, LA E67B, LO E67B, LY E67B, LB E67C, LV E67C, LT E67C LW T67C LS T679, LY T679, LG T679 LS T770, LO T770, LY T770, LG T770, LP T770 LB T773, LV T773, LT T773, LW T773 LH T774 LS E675, LA E675, LY E675, LS T675 LS T776, LA T776, LO T776, LY T776, LB T776 LHGB T686 LT T68C, LB T68C - Hyper Mini TOPLED® LB M676 - Mini TOPLED Santana® LG M470 LS M47K, LO M47K, LY M47K Source: http://www.osram.convergy.de LUXEON: - LUMILED® LXK2-PW12-R00, LXK2-PW12-S00, LXK2-PW14-U00, LXK2-PW14-V00 LXK2-PM12-R00, LXK2-PM12-S00, LXK2-PM14-U00 LXK2-PE12-Q00, LXK2-PE12-R00, LXK2-PE12-S00, LXK2-PE14-T00, LXK2-PE14-U00 LXK2-PB12-K00, LXK2-PB12-L00, LXK2-PB12-M00, LXK2-PB14-N00, LXK2-PB14-P00, LXK2-PB14-Q00 LXK2-PR12-L00, LXK2-PR12-M00, LXK2-PR14-Q00, LXK2-PR14-R00 LXK2-PD12-Q00, LXK2-PD12-R00, LXK2-PD12-S00 LXK2-PH12-R00, LXK2-PH12-S00 LXK2-PL12-P00, LXK2-PL12-Q00, LXK2-PL12-R00 Source: www.luxeon.com KINGBRIGHT: KA-3528ASYC Source: www.kingbright.com
D14 = SparkFun-LED:LED-RGB: LED-RGB 6 pin RGB LED (no common connector) Packages: PLCC-6 LED-TRICOLOR-5050 - No built-in IC SparkFun Products: Digital Sandbox <https://www.sparkfun.com/products/12651> LED- SMD RGB <https://www.sparkfun.com/products/10866>; PROD_ID: DIO-12113; VALUE: RGB
DC1 = MBP_jacks:DC_KOBICONN
FSW1 FSW2 = MBP_switches:MOMENTARY
IC1 = microchip:PIC18F8*J5: PIC18F87J50 Family 64/80-Pin High-Performance, 1-Mbit Flash USB Microcontrollers with nanoWatt Technology Source: http://ww1.microchip.com/downloads/en/DeviceDoc/39775b.pdf; MPN: PIC18F85J50-I/PT; OC_FARNELL: 1439565; OC_NEWARK: 59M1134
IC2-IC4 = 45xx:4532: 8-bit PRIORITY ENCODER
IC5 = Microchip:24LC04B
IC6 = LDO_Regulators:LMS8117A
LOCK MODE = MBP_switches:SPDT: TOGGLE SWITCH Marquardt
POT0 POT1-POT9 = MBP_potentiometers:POTS
PROG = con-lstb:MA06-1: PIN HEADER; OC_FARNELL: unknown; OC_NEWARK: unknown
Q1-Q15 = semicon-smd-ipc:NPN-TRANSISTOR_: NPN TRANSISTOR
R1-R12 R18-R47 R80-R82 = MBP_SMD:RESISTOR
R13-R17 R48-R79 = MBP_SMD:RESISTOR; SPICEPREFIX: R
S1-S5 = SparkFun-Switches:MOMENTARY-SWITCH-SPST: Momentary Switch (Pushbutton) - SPST Normally-open (NO) SPST momentary switches (buttons, pushbuttons). Variants PTH-12MM - 12mm square, through-hole Momentary Pushbutton Switch - 12mm Square <https://www.sparkfun.com/products/9190> (COM-09190) PTH-6.0MM, PTH-6.0MM-KIT - 6.0mm square, through-hole Mini Pushbutton Switch <https://www.sparkfun.com/products/97> (COM-00097) KIT package intended for soldering kit's - only one side of pads' copper is exposed. PTH-RIGHT-ANGLE-KIT - Right-angle, through-hole Right Angle Tactile Button <https://www.sparkfun.com/products/10791> - Used on SparkFun BigTime Watch Kit <https://www.sparkfun.com/products/11734> SMD-12MM - 12mm square, surface-mount Tactile Button - SMD (12mm) <https://www.sparkfun.com/products/12993> (COM-12993) Used on SparkFun PicoBoard <https://www.sparkfun.com/products/11888> SMD-4.5MM - 4.5mm Square Trackball Switch Used on SparkFun Blackberry Trackballer Breakout <https://www.sparkfun.com/products/13169> SMD-4.6MMX2.8MM - 4.60mm x 2.80mm, surface mount Used on SparkFun SAMD21 Mini Breakout <https://www.sparkfun.com/products/13664> SMD-5.2MM, SMD-5.2-REDUNDANT - 5.2mm square, surface-mount Mini Pushbutton Switch - SMD <https://www.sparkfun.com/products/8720> (COM-08720) Used on Arduino Pro Mini <https://www.sparkfun.com/products/11114> REDUNDANT package connects both switch circuits together SMD-6.0X3.5MM - 6.0 x 3.5mm, surface mount Momentary Reset Switch SMD <https://www.sparkfun.com/products/8229> (COM-08229) SMD-6.2MM-TALL - 6.2mm square, surface mount Tactile Button - SMD (6mm) <https://www.sparkfun.com/products/12992> Used on SparkFun Digital Sandbox <https://www.sparkfun.com/products/12651> SMD-RIGHT-ANGLE - Right-angle, surface mount Used on SparkFun Block for Intel® Edison - Arduino <https://www.sparkfun.com/products/13036>; PROD_ID: SWCH-08441; SF_SKU: COM-00097; SPICEPREFIX: B
SPR1 = 'A'-SIZE-PC-SPRING:SPRING
SW1-SW3 = MBP_switches:1P8T
T2 = zetex:PMOSSOT23: MOS FET; OC_FARNELL: unknown; OC_NEWARK: unknown

## Board
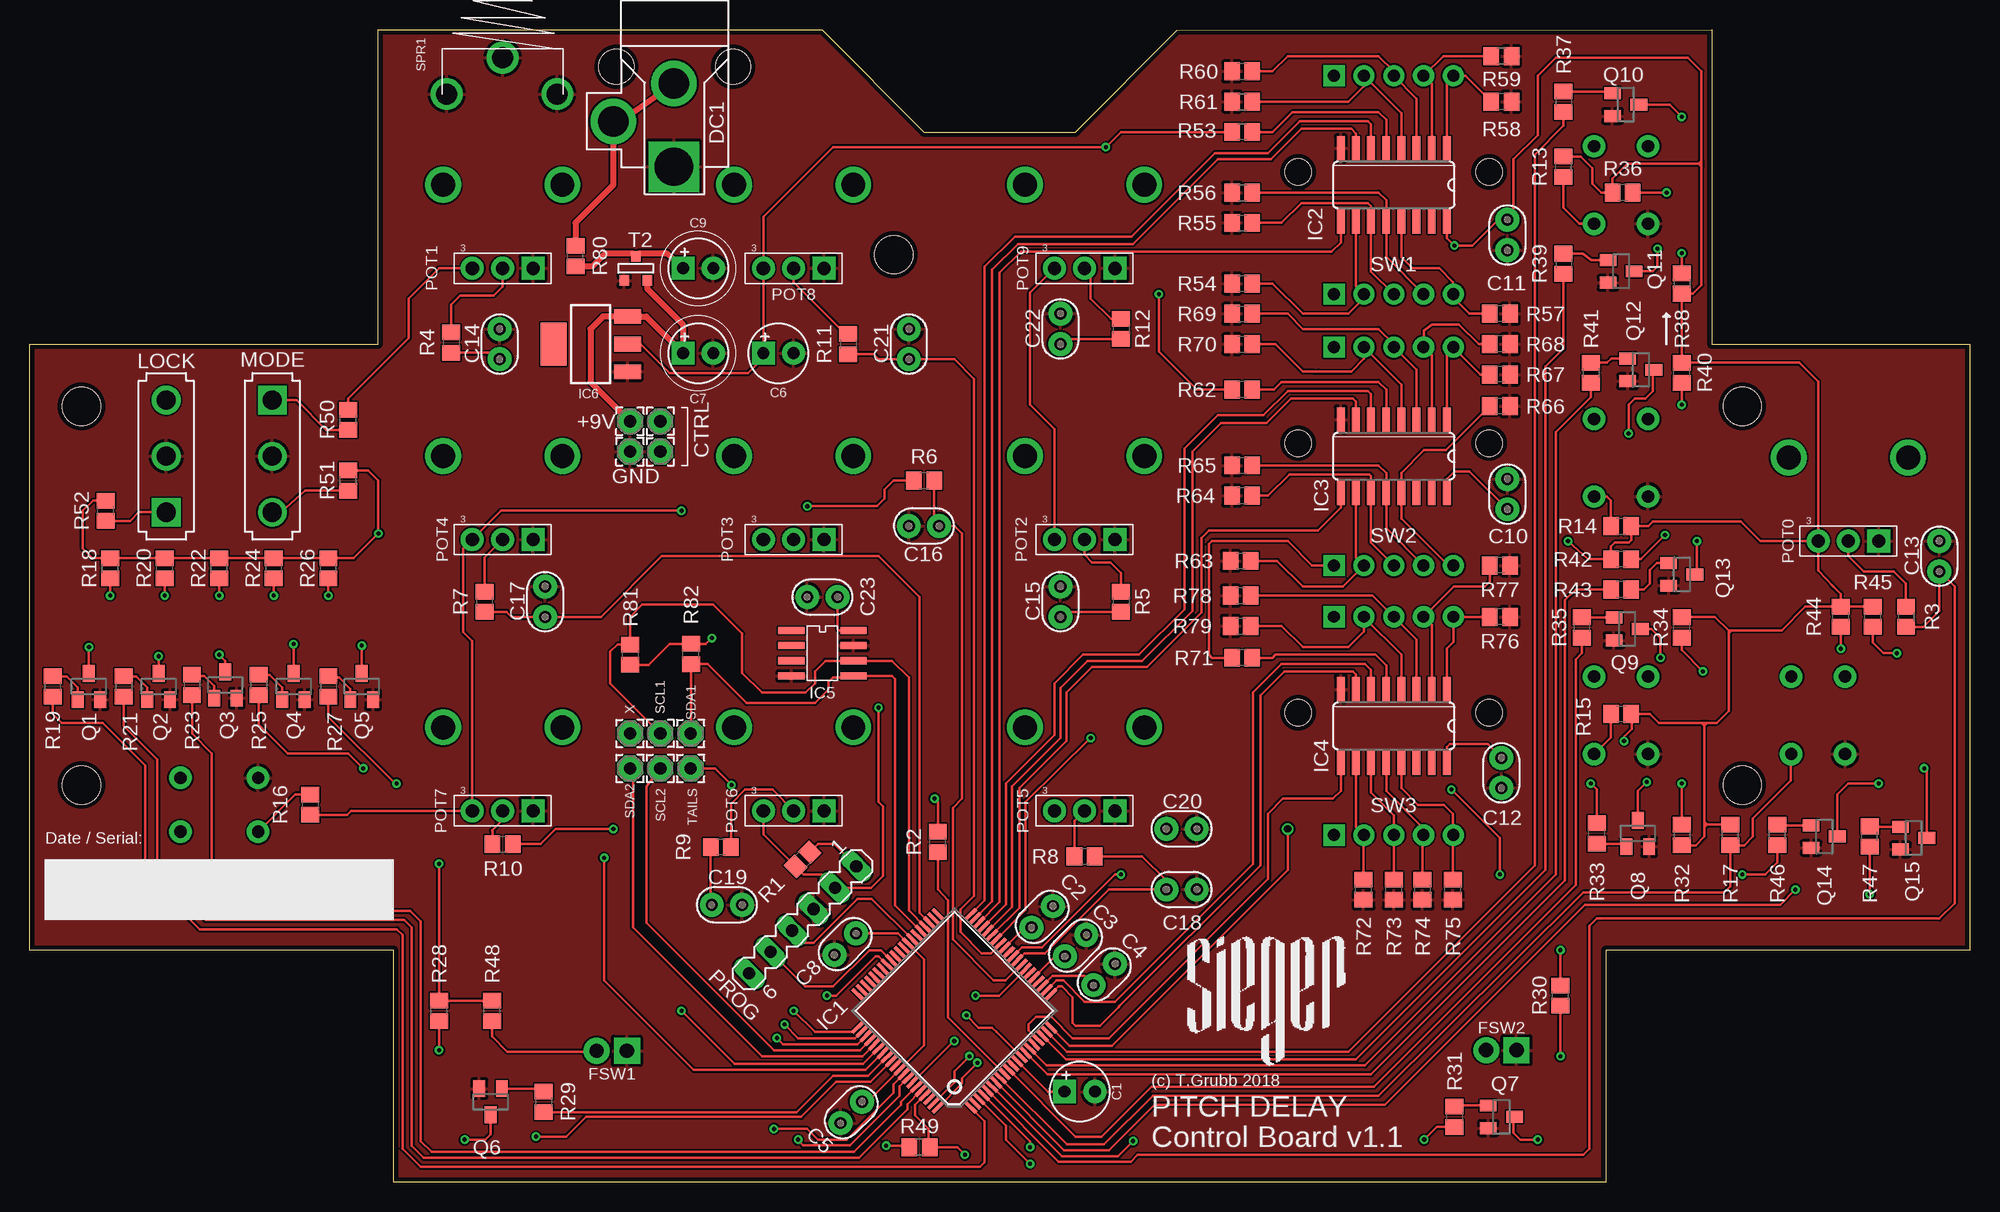
[diagram p4: board, top side]
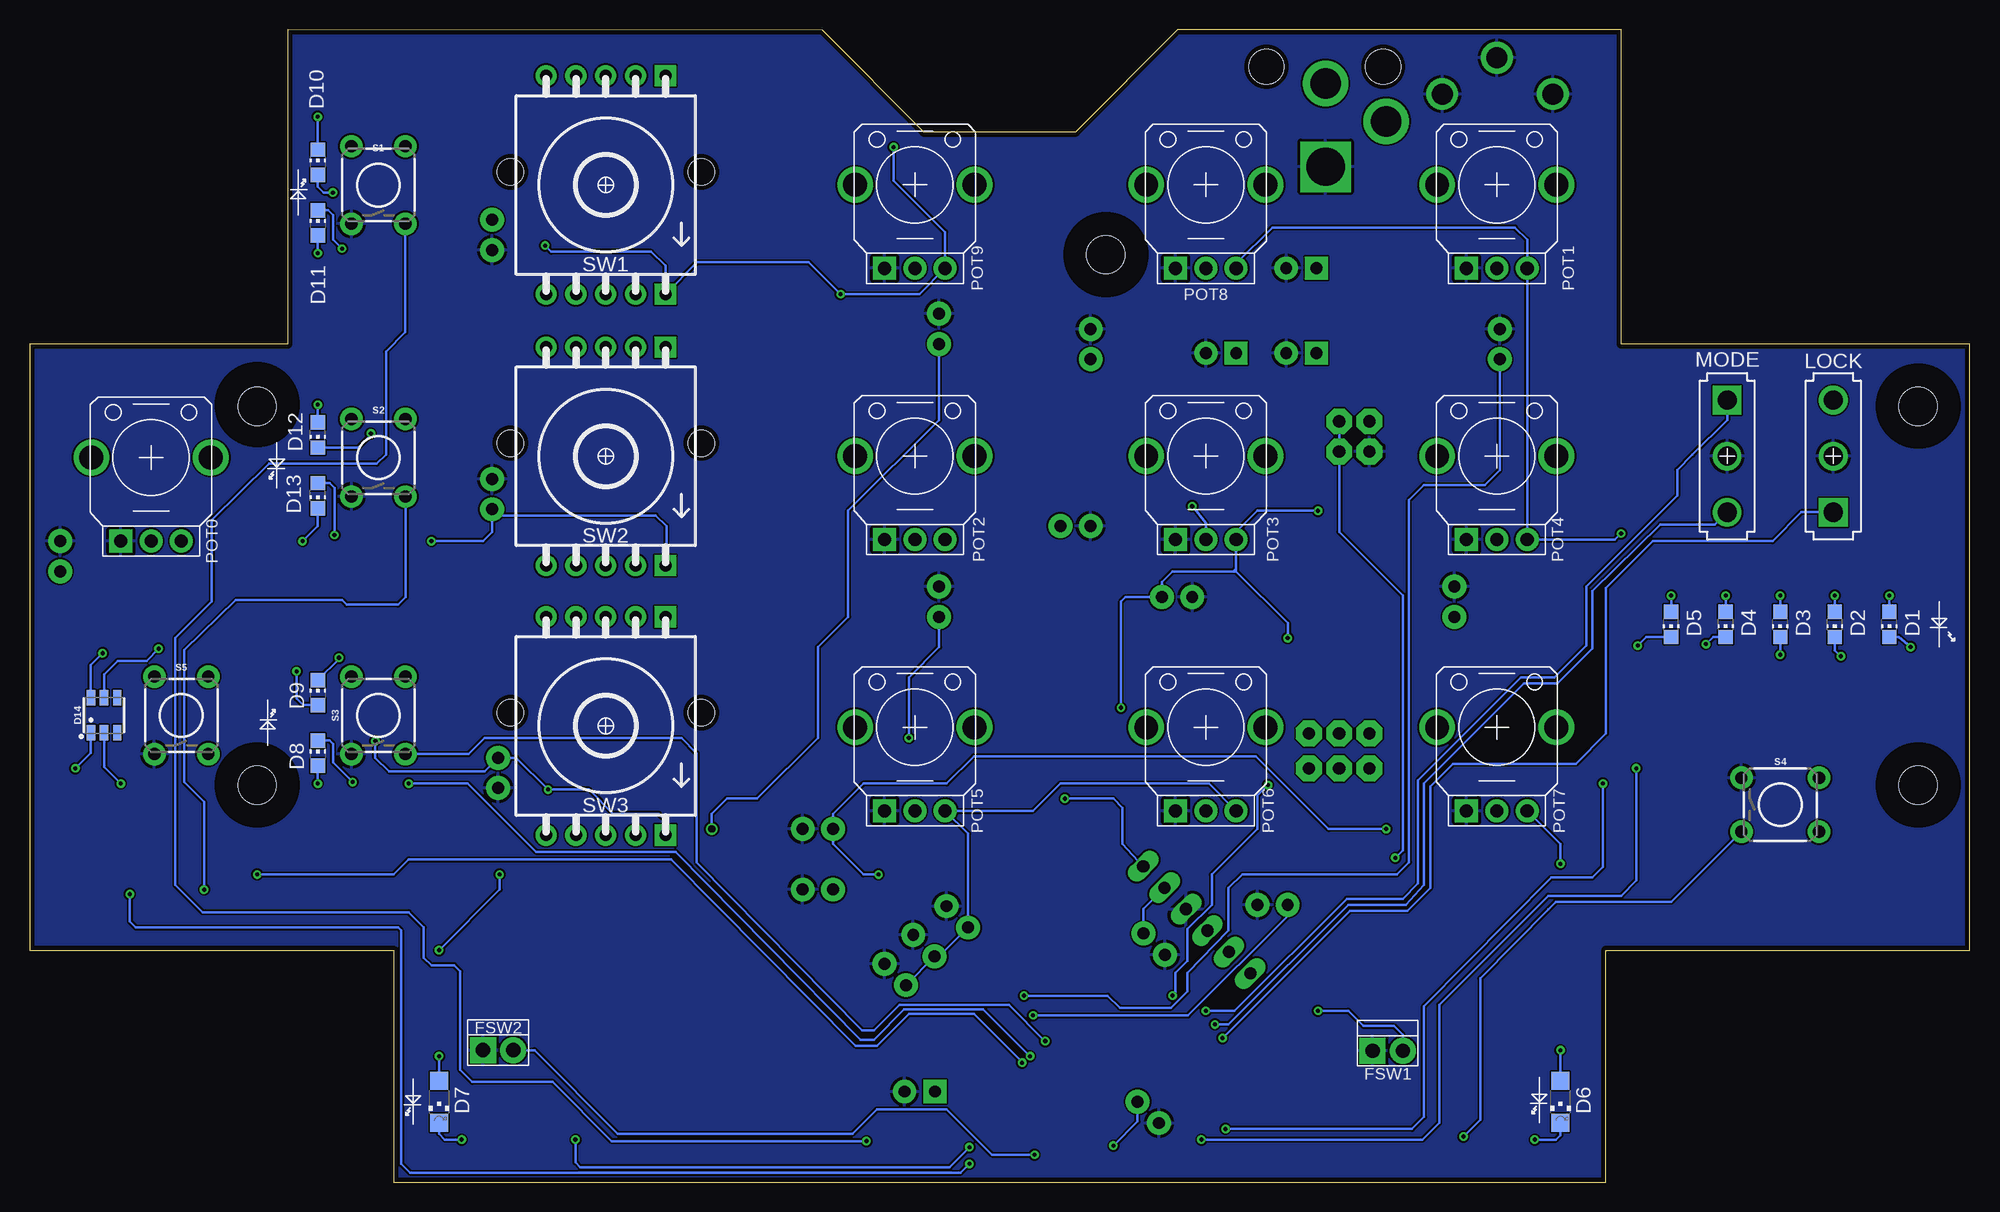
[diagram p5: board, bottom side, seen from below]

Size 162.56 x 96.57 mm. Coordinates in mm from the lower left corner, seen from the top.
Outline: 162.56,19.43 132.08,19.43 132.08,0 30.48,0 30.48,19.43 0,19.43 0,70.23 29.21,70.23 29.21,96.57 66.37,96.57 74.93,88.01 87.63,88.01 96.14,96.52 140.97,96.57 140.97,70.23 162.56,70.23 162.56,19.43
Copper layers (1*16): Top 0.0356mm / dielectric 1.5011mm / Bottom 0.0356mm
Design rules "LaenPCBOrder": minimum track width 6mil, minimum drill 13mil, track to track 6mil, track to pad 6mil, pad to pad 6mil, via to via 6mil, smd to smd 6mil, copper to edge 15mil, drill to drill 6mil, minimum pad ring 7mil, minimum via ring 7mil, stop-mask expansion 3mil, vias tented up to drill 0mil, thermal gap 10mil
Holes 3.2 mm at 4.32,65.02 4.32,33.27 143.51,33.27 143.51,65.02 72.39,77.72
Holes 2.92 mm at 49.15,93.47 58.93,93.47
bRestrict: area 0.8,29.8 to 7.8,36.8; area 0.8,61.5 to 7.8,68.5; area 68.9,74.2 to 75.9,81.2; area 140,29.8 to 147,36.8; area 140,61.7 to 147,68.7

### Footprints (pad centres in the part's own frame; a part is rotated, then mirrored left to right if it is on the bottom)
2,15/1,0 = drill 1.016 pad 2.159 octagon: 1 0,0
050_020_1 = drill 1 pad 1.93 square: + -1.27,0 | drill 1 pad 1.93: - 1.27,0
050X030_025 = drill 1 pad 2: 1 -1.27,0; 2 1.27,0
CHIP-LED0805 = smd 1.2 x 1.2: A 0,-1.05; C 0,1.05
CHIPLED_1206 = smd 1.5 x 1.5: A 0,-1.75; C 0,1.75
PLCC-6-LED = smd 1.3 x 0.7: AB 1.475,1.1; AG 1.475,-1.1; AR 1.475,0; CB -1.475,1.1; CG -1.475,-1.1; CR -1.475,0
DC_KOBICONN = drill 2.54 pad 3.81: R 0,5.08; S 3.175,0 | drill 3.2 pad 3.81 square: T -3.81,0
SPST = drill 1.2 pad 2.184 square: 1 -1.27,0 | drill 1.2 pad 2.184: 2 1.27,0
TQFP80-12X12 = smd 1.2 x 0.3: 1 -6.725,4.75; 2 -6.725,4.25; 3 -6.725,3.75; 4 -6.725,3.25; 5 -6.725,2.75; 6 -6.725,2.25; 7 -6.725,1.75; 8 -6.725,1.25; 9 -6.725,0.75; 10 -6.725,0.25; 11 -6.725,-0.25; 12 -6.725,-0.75; 13 -6.725,-1.25; 14 -6.725,-1.75; 15 -6.725,-2.25; 16 -6.725,-2.75; 17 -6.725,-3.25; 18 -6.725,-3.75; 19 -6.725,-4.25; 20 -6.725,-4.75; 41 6.725,-4.75; 42 6.725,-4.25; 43 6.725,-3.75; 44 6.725,-3.25; 45 6.725,-2.75; 46 6.725,-2.25; 47 6.725,-1.75; 48 6.725,-1.25; 49 6.725,-0.75; 50 6.725,-0.25; 51 6.725,0.25; 52 6.725,0.75; 53 6.725,1.25; 54 6.725,1.75; 55 6.725,2.25; 56 6.725,2.75; 57 6.725,3.25; 58 6.725,3.75; 59 6.725,4.25; 60 6.725,4.75 | smd 0.3 x 1.2: 21 -4.75,-6.725; 22 -4.25,-6.725; 23 -3.75,-6.725; 24 -3.25,-6.725; 25 -2.75,-6.725; 26 -2.25,-6.725; 27 -1.75,-6.725; 28 -1.25,-6.725; 29 -0.75,-6.725; 30 -0.25,-6.725; 31 0.25,-6.725; 32 0.75,-6.725; 33 1.25,-6.725; 34 1.75,-6.725; 35 2.25,-6.725; 36 2.75,-6.725; 37 3.25,-6.725; 38 3.75,-6.725; 39 4.25,-6.725; 40 4.75,-6.725; 61 4.75,6.725; 62 4.25,6.725; 63 3.75,6.725; 64 3.25,6.725; 65 2.75,6.725; 66 2.25,6.725; 67 1.75,6.725; 68 1.25,6.725; 69 0.75,6.725; 70 0.25,6.725; 71 -0.25,6.725; 72 -0.75,6.725; 73 -1.25,6.725; 74 -1.75,6.725; 75 -2.25,6.725; 76 -2.75,6.725; 77 -3.25,6.725; 78 -3.75,6.725; 79 -4.25,6.725; 80 -4.75,6.725
SO16 = smd 0.66 x 2.032: 1 -4.445,-3.073; 2 -3.175,-3.073; 3 -1.905,-3.073; 4 -0.635,-3.073; 5 0.635,-3.073; 6 1.905,-3.073; 7 3.175,-3.073; 8 4.445,-3.073; 9 4.445,3.073; 10 3.175,3.073; 11 1.905,3.073; 12 0.635,3.073; 13 -0.635,3.073; 14 -1.905,3.073; 15 -3.175,3.073; 16 -4.445,3.073
SOIC8 = smd 0.6 x 2.2: 1 -1.905,-2.6; 2 -0.635,-2.6; 3 0.635,-2.6; 4 1.905,-2.6; 5 1.905,2.6; 6 0.635,2.6; 7 -0.635,2.6; 8 -1.905,2.6
SOT223 = smd 1.219 x 2.235: 1 -2.311,-3.099; 2 0,-3.099; 3 2.311,-3.099 | smd 3.6 x 2.2: 4 0,3.099
1MS1T1B1C0M2QE = drill 1.6 square: 1 4.699,0 | drill 1.6: 2 0,0; 3 -4.699,0
9MM_W/MOUNTS-2MMHOLES = drill 1.1 pad 1.93 square: P$1 2.54,0 | drill 1.1 pad 1.93: P$2 0,0; P$3 -2.54,0 | drill 2: P$4 -5,7; P$5 5,7
MA06-1 = drill 1.016 long: 1 -6.35,0; 2 -3.81,0; 3 -1.27,0; 4 1.27,0; 5 3.81,0; 6 6.35,0
SOT23 = smd 1 x 1.4: 1 -0.95,-1.1; 2 0.95,-1.1; 3 0,1.1
RESISTOR_C0805 = smd 1.3 x 1.5: 1 -0.85,0; 2 0.85,0
TACTILE_SWITCH_PTH_6.0MM = drill 1.016 pad 1.88: 1 -3.251,2.261; 2 3.251,2.261; 3 -3.251,-2.261; 4 3.251,-2.261
'A'SIZE-PC-SPRING = drill 1.77: P$1 -4.699,0; P$2 4.572,0; P$3 0,3.048
SMALLROTARY = drill 1 pad 1.778: 1 -2.5,-9.15; 2 0,-9.15; 3 2.5,-9.15; 4 5,-9.15; 5 5,9.15; 6 2.5,9.15; 7 0,9.15; 8 -2.5,9.15 | drill 1 pad 1.778 square: 9 -5,9.15; C -5,-9.15 | hole 2.2: 8,1.1; -8,1.1
SOT-23 = smd 0.787 x 0.889: 1 0.025,-1.016; 2 -0.94,1.016; 3 0.991,1.016

### Placement (x,y rotation side)
+9V  50.29,63.75 270 top
C1  87.97,7.58 0 top
C2  84.84,22.23 45 top
C3  87.63,19.81 45 top
C4  90.04,17.4 45 top
C5  68.83,5.84 225 top
C6  62.74,69.47 0 top
C7  56.01,69.47 0 top
C8  68.33,19.94 225 top
C9  56.01,76.58 0 top
C10  123.82,57.66 270 top
C11  123.82,79.38 90 top
C12  123.32,34.29 90 top
C13  160.02,52.45 90 top
C14  39.37,70.23 90 top
C15  86.36,48.64 90 top
C16  74.93,54.99 180 top
C17  43.18,48.64 90 top
C18  96.52,24.51 0 top
C19  58.42,23.24 0 top
C20  96.52,29.59 0 top
C21  73.66,70.23 90 top
C22  86.36,71.5 90 top
C23  66.42,49.02 180 top
CTRL  52.83,63.75 0 top
CTRL1  52.83,61.21 180 top
D1  6.73,46.74 180 bottom
D2  11.3,46.74 180 bottom
D3  15.88,46.74 180 bottom
D4  20.45,46.74 180 bottom
D5  25.02,46.74 180 bottom
D6  34.29,6.73 180 bottom
D7  128.27,6.73 180 bottom
D8  138.43,35.94 0 bottom
D9  138.43,41.02 0 bottom
D10  138.43,85.47 0 bottom
D11  138.43,80.39 0 bottom
D12  138.43,62.61 180 bottom
D13  138.43,57.53 180 bottom
D14  156.34,39.12 90 bottom
DC1  53.98,88.9 90 top
FSW1  48.77,11 0 bottom
FSW2  123.32,11.05 0 bottom
GND  50.29,61.21 270 top
IC1  77.47,14.35 135 top
IC2  114.3,83.57 180 top
IC3  114.3,60.83 180 top
IC4  114.3,38.23 180 top
IC5  66.42,44.32 270 top
IC6  46.99,70.23 90 top
LOCK  11.43,60.83 270 top
MODE  20.32,60.83 90 top
POT0  152.4,53.72 0 top
POT1  39.62,76.58 0 top
POT2  88.39,53.85 0 top
POT3  64.01,53.85 0 top
POT4  39.62,53.85 0 top
POT5  88.39,31.12 0 top
POT6  64.01,31.12 0 top
POT7  39.62,31.12 0 top
POT8  64.01,76.58 0 top
POT9  88.39,76.58 0 top
PROG  64.77,21.97 225 top
Q1  4.95,41.53 0 top
Q2  10.8,41.53 0 top
Q3  16.38,41.66 0 top
Q4  22.1,41.53 0 top
Q5  27.81,41.53 0 top
Q6  38.61,6.73 180 top
Q7  123.32,5.46 270 top
Q8  134.75,29.21 0 top
Q9  133.86,46.35 270 top
Q10  133.73,90.3 270 top
Q11  133.35,76.33 270 top
Q12  135,68.07 270 top
Q13  138.43,50.93 270 top
Q14  150.37,28.96 270 top
Q15  157.86,28.83 270 top
R1  64.77,27.05 225 top
R2  76.09,28.5 90 top
R3  157.23,47.37 270 top
R4  35.31,70.36 270 top
R5  91.44,48.64 270 top
R6  74.93,58.8 0 top
R7  38.1,48.64 270 top
R8  88.39,27.3 0 top
R9  57.91,28.07 180 top
R10  39.62,28.32 0 top
R11  68.58,70.23 270 top
R12  91.44,71.5 270 top
R13  128.52,85.09 90 top
R14  133.35,54.99 0 top
R15  133.35,39.24 0 top
R16  23.5,31.62 270 top
R17  142.49,29.08 90 top
R18  6.73,51.44 90 top
R19  1.91,41.53 270 top
R20  11.3,51.44 90 top
R21  7.87,41.53 270 top
R22  15.88,51.44 90 top
R23  13.59,41.66 270 top
R24  20.45,51.44 90 top
R25  19.18,41.66 270 top
R26  25.02,51.44 90 top
R27  25.02,41.53 270 top
R28  34.29,14.35 90 top
R29  43.05,6.73 270 top
R30  128.27,15.62 90 top
R31  119.38,5.46 270 top
R32  138.43,29.08 270 top
R33  131.32,29.21 90 top
R34  138.43,46.48 90 top
R35  130.05,46.48 270 top
R36  133.48,82.93 180 top
R37  128.52,90.55 270 top
R38  138.43,75.31 270 top
R39  128.52,76.96 270 top
R40  138.43,67.82 90 top
R41  130.81,67.82 270 top
R42  133.35,52.2 180 top
R43  133.35,49.66 180 top
R44  151.77,47.37 90 top
R45  154.43,47.37 90 top
R46  146.43,29.08 90 top
R47  154.18,28.96 90 top
R48  38.73,14.35 90 top
R49  74.55,2.92 180 top
R50  26.67,63.88 90 top
R51  26.67,58.8 90 top
R52  6.35,56.26 90 top
R53  101.6,88.01 180 top
R54  101.6,75.31 0 top
R55  101.6,80.39 0 top
R56  101.6,82.93 0 top
R57  123.19,72.77 180 top
R58  123.32,90.55 180 top
R59  123.32,94.36 180 top
R60  101.6,93.09 0 top
R61  101.6,90.55 0 top
R62  101.6,66.42 180 top
R63  101.47,52.07 0 top
R64  101.6,57.53 0 top
R65  101.6,60.07 0 top
R66  123.19,65.02 180 top
R67  123.19,67.69 180 top
R68  123.19,70.23 180 top
R69  101.6,72.77 0 top
R70  101.6,70.23 0 top
R71  101.6,43.94 180 top
R72  111.76,24.51 90 top
R73  114.3,24.51 90 top
R74  116.71,24.51 90 top
R75  119.25,24.51 90 top
R76  123.19,47.37 180 top
R77  123.19,51.69 180 top
R78  101.47,49.15 0 top
R79  101.47,46.61 0 top
R80  45.72,77.6 90 top
R81  50.29,44.2 270 top
R82  55.41,44.25 90 top
S1  133.35,83.57 90 bottom
S2  133.35,60.71 90 bottom
S3  133.35,39.12 90 bottom
S4  15.88,31.62 0 bottom
S5  149.86,39.12 90 bottom
SCL1  52.83,37.59 0 top
SCL2  52.83,34.67 180 top
SDA1  55.37,37.59 180 top
SDA2  50.29,34.67 180 top
SPR1  39.62,91.19 0 top
SW1  114.3,83.57 0 top
SW2  114.3,60.83 0 top
SW3  114.3,38.23 0 top
T2  50.8,76.58 180 top
TAILS  55.37,34.67 180 top
U$1  [LARGE]  103.63,14 0 top
X  50.29,37.59 180 top

### Tracks (layer width: path | path; a pad name or v marks a point on that pad's centre or on a via)
9V
  Top 0.508: +9V.1 46.99,67.06 46.99,71.5 48.03,72.54 IC6.3 51.66,72.54 C7.+ 54.74,71.88 51.74,74.88 T2.2
!MCLR  (via drill 0.35)
  Top 0.203: v75.82,32.13 76.09,31.86 R2.2 | PROG.1 67.4,28.32 66.04,28.32 R1.1
  Bottom 0.203: v75.82,32.13 71.75,32.13 70.99,31.37 70.99,28.32 PROG.1
CTRL  (via drill 0.35)
  Top 0.203: v48.13,27.18 48.13,16.89 55.63,9.4 70.04,9.4 IC1.67
  Bottom 0.203: CTRL.1 CTRL1.1 52.83,54.48 47.5,49.15 47.5,27.81 v48.13,27.18
CV0  (via drill 0.35)
  Top 0.203: IC1.30 83.16,19.68 84.84,19.68 90.93,25.78 v91.44,25.78 | R10.2 42.8,28.32 44.07,29.59 v48.9,29.59
  Bottom 0.203: v91.44,25.78 92.71,25.78 95.25,28.32 C20.1 95.25,30.86 92.71,33.4 85.72,33.4 83.44,35.69 59.82,35.69 53.72,29.59 v48.9,29.59
CV1
  Top 0.203: 83.36,19.18 85.09,19.18 90.42,24.51 C18.1 95.25,25.27 93.22,27.3 R8.2 | 83.36,19.18 | IC1.29 83.36,19.18
CV2
  Top 0.203: IC1.28 81.78,16.89 80.77,16.89 77.34,20.32 77.34,31.37 78.1,32.13 78.1,54.36 77.47,54.99 C16.1 75.78,55.41 R6.2
CV3  (via drill 0.35)
  Top 0.203: IC1.27 81.21,15.62 v79.25,15.62 | 35.6,69.22 R4.2 38.82,69.51 C14.1
  Bottom 0.203: v79.25,15.62 72.24,15.62 71.22,14.61 66.93,14.61 65.53,16 65.53,17.53 62.1,21.08 62.1,24.64 60.96,25.78 48.01,25.78 46.99,26.8 46.99,57.15 45.72,58.42 40.64,58.42 39.37,59.69 C14.1
CV4
  Top 0.203: IC1.33 80.53,19.18 79.76,19.18 77.98,20.96 77.98,22.86 79.12,24 79.12,67.31 77.47,68.96 C21.1 71.12,68.96 70.7,69.38 R11.2
CV5  (via drill 0.35)
  Top 0.203: IC1.13 81.03,12.57 80.63,12.94 79.5,12.94 v78.49,13.97 | R9.2 57.06,23.33 C19.1
  Bottom 0.203: C19.1 57.15,22.32 65.5,13.97 v78.49,13.97
CV6  (via drill 0.35)
  Top 0.203: IC1.34 83.44,22.8 83.44,31.88 v88.9,37.21 | R5.2 86.78,47.79 C15.1
  Bottom 0.203: v88.9,37.21 88.9,42.29 86.36,44.83 C15.1
CV7  (via drill 0.6)
  Top 0.203: v105.41,29.59 105.41,26.16 90.68,11.43 87.11,11.43 IC1.20 | C22.1 86.78,70.65 R12.2
  Bottom 0.203: v105.41,29.59 105.41,30.86 104.14,32.13 101.6,32.13 96.52,37.21 96.52,44.83 93.98,47.37 93.98,56.26 86.36,63.88 C22.1
CV8
  Top 0.203: IC1.5 86.22,1.71 92.27,1.71 92.84,2.29 130.18,2.29 130.68,2.79 130.68,21.46 131.32,22.1 160.02,22.1 161.29,23.37 161.29,49.91 C13.1 160.02,47.88 158.66,46.52 R3.2
CV9
  Top 0.203: IC1.43 74.55,22.57 74.55,49.02 71.12,52.45 52.96,52.45 47.88,47.37 C17.1 40.39,47.37 39.97,47.79 R7.2
FSW1  (via drill 0.35)
  Top 0.203: FSW1.2 47.41,10.96 47.37,10.92 40.01,10.92 38.73,12.19 R48.1 | IC1.66 69.84,9.91 59.05,9.91 v54.61,14.35
  Bottom 0.203: FSW1.2 47.5,12.32 48.26,13.08 50.8,13.08 52.07,14.35 v54.61,14.35
FSW2  (via drill 0.35)
  Top 0.203: v78.36,2.29 77.72,2.92 R49.1 75.31,3.39 75.31,4.45 74.17,5.59 74.17,6.45 IC1.77 75.01,7.32
  Bottom 0.203: FSW2.2 120.27,11.05 113.28,4.06 93.6,4.06 91.57,6.1 85.72,6.1 81.91,2.29 v78.36,2.29
INTA0
  Top 0.203: IC2.9 109.85,78.74 109.09,77.98 83.06,77.98 81.28,76.2 81.28,24.51 81.28,23.46 | IC1.38 81.28,23.46 | 81.28,23.46
INTA1
  Top 0.203: IC2.7 111.12,87.88 110.74,88.27 106.55,88.27 104.01,85.72 99.57,85.72 92.46,78.61 82.8,78.61 80.64,76.45 80.64,23.54 IC1.39
INTA2
  Top 0.203: IC2.6 112.39,88.65 112.14,88.9 106.43,88.9 103.76,86.23 99.31,86.23 92.33,79.25 82.55,79.25 80.01,76.71 80.01,23.61 IC1.40
INTB0
  Top 0.203: IC3.9 109.85,56.52 107.95,54.61 98.81,54.61 98.17,53.98 98.17,47.75 93.6,43.18 89.03,43.18 86.87,41.02 86.87,36.96 82.93,33.02 82.93,22.99 | 82.93,22.99 | IC1.35 82.93,22.99
INTB1
  Top 0.203: IC3.7 111.12,65.41 110.87,65.66 105.66,65.66 103.63,63.63 99.82,63.63 97.41,61.21 97.41,47.88 93.22,43.69 88.65,43.69 86.36,41.4 86.36,37.21 82.3,33.15 82.3,23.07 IC1.36
INTB2
  Top 0.203: IC3.6 112.39,66.04 112.14,66.29 105.41,66.29 103.38,64.26 99.57,64.26 96.77,61.47 96.77,48.01 92.96,44.2 88.27,44.2 85.85,41.78 85.85,37.47 81.79,33.4 81.79,23.27 IC1.37 | IC1.37
INTC0
  Top 0.203: IC4.9 109.85,32.77 109.22,32.13 105.03,32.13 103.76,30.86 103.76,25.4 90.42,12.06 87.38,12.06 85.6,13.84 84.33,13.84 83.69,13.21 83.69,12.7 84.5,11.89 IC1.17
INTC1
  Top 0.203: IC4.7 111.12,42.55 110.87,42.8 105.16,42.8 103.12,40.77 103.12,26.55 91.33,14.76 91.21,14.63 89.66,13.08 87.63,13.08 87.38,13.34 87.38,15.49 86.49,16.38 86.22,16.38 IC1.21
INTC2
  Top 0.203: IC4.6 112.39,42.93 111.89,43.43 104.9,43.43 102.49,41.02 102.49,26.67 90.93,15.11 88.39,15.11 86.61,16.89 86.02,16.89 IC1.22
LED1
  Top 0.203: R19.2 1.91,39.24 2.67,38.48 6.1,38.48 9.65,34.92 9.65,25.78 14.25,21.18 30.76,21.18 31.24,20.7 31.24,2.79 32.77,1.27 79.63,1.27 80.01,1.65 80.01,5.09 IC1.1
LED2
  Top 0.203: IC1.76 73.53,6.53 73.53,6.1 69.47,2.03 33.02,2.03 32,3.05 32,21.34 31.37,21.97 14.73,21.97 10.67,26.04 10.67,35.43 7.87,38.23 R21.2
LED3
  Top 0.203: R23.2 13.59,37.59 15.24,35.94 15.24,25.78 18.29,22.73 31.88,22.73 32.77,21.84 32.77,3.43 33.66,2.54 69.09,2.54 73.02,6.48 73.02,6.73 74.3,8 IC1.75
LED4  (via drill 0.35)
  Top 0.203: R25.2 19.18,38.35 21.59,35.94 26.67,35.94 v27.94,34.67 | v64.39,3.56 64.79,3.07 68.73,3.07 72.9,7.24 72.9,8.01 IC1.73
  Bottom 0.203: v27.94,34.67 27.94,25.27 29.21,24 35.31,24 44.45,14.86 44.45,4.95 45.85,3.56 v64.39,3.56
LED5  (via drill 0.35)
  Top 0.203: R27.2 25.02,38.99 30.73,33.27 v30.73,33.4 | v62.36,4.45 65.15,4.45 66.04,3.56 68.45,3.56 72.39,7.49 72.39,8.21 IC1.72
  Bottom 0.203: v30.73,33.4 30.73,26.42 31.62,25.53 35.05,25.53 45.72,14.73 45.72,5.46 46.74,4.45 v62.36,4.45
LED6
  Top 0.203: R29.2 43.09,5.84 64.26,5.84 67.31,8.89 70.24,8.89 IC1.68
LED7  (via drill 0.35)
  Top 0.203: IC1.4 83.82,3.41 v83.82,2.92 | v116.84,3.56 117.89,4.61 R31.2
  Bottom 0.203: v83.82,2.92 85.5,1.25 116.43,1.25 116.84,1.65 v116.84,3.56
LED8  (via drill 0.35)
  Top 0.203: R33.2 131.32,32.89 v130.81,33.4 | IC1.79 77.47,8.34 77.47,9.27 v78.74,10.54
  Bottom 0.203: v130.81,33.4 125.86,33.4 120.14,27.69 108.46,27.69 92.96,11.94 91.82,11.94 89.28,14.48 82.68,14.48 v78.74,10.54
LED9
  Top 0.203: R35.2 130.05,44.32 129.54,43.81 129.54,42.97 129.54,24.89 112.65,8 93.98,8 89.79,3.81 87.63,3.81 82.05,9.39 IC1.10
LED10
  Top 0.203: R37.2 128.52,88.52 126.11,86.11 126.11,26.54 110.49,10.92 86.91,10.92 IC1.19
LED11
  Top 0.203: R39.2 128.52,69.85 127,68.33 127,26.16 111.12,10.29 86.84,10.29 IC1.18
LED12
  Top 0.203: R41.2 130.81,65.79 127.89,62.87 127.89,25.78 111.89,9.78 85.22,9.78 83.82,11.18 IC1.15
LED13
  Top 0.203: R43.2 129.54,49.66 128.65,48.77 128.65,25.27 112.39,9.02 85.28,9.02 IC1.14
LEDB  (via drill 0.35)
  Top 0.203: R47.1 v154.18,24.13 | v83.82,1.52 81.79,3.56 81.79,4.73 IC1.3
  Bottom 0.203: v154.18,24.13 154.18,21.84 153.67,21.34 131.7,21.34 131.45,21.08 131.45,1.52 130.68,0.76 84.58,0.76 v83.82,1.52
LEDR  (via drill 0.35)
  Top 0.203: R46.1 146.43,26.8 145.42,25.78 v143.51,25.78 | v79.41,10 78.1,8.69 78.1,8.25 76.09,6.24 IC1.80
  Bottom 0.203: v143.51,25.78 132.08,25.78 130.81,27.05 108.84,27.05 93.34,11.43 91.57,11.43 88.9,14.1 83.44,14.1 79.38,10.03 v79.41,10
LOCK  (via drill 0.35)
  Top 0.203: R52.1 8.42,55.41 9.14,56.13 LOCK.1 | v62.61,12.06 63.12,11.56 69.37,11.56 IC1.63
  Bottom 0.203: LOCK.1 14.1,56.13 16.51,53.72 26.54,53.72 30.48,49.78 30.48,37.59 33.02,35.05 43.31,35.05 45.21,33.15 45.21,24.64 47.12,22.73 51.94,22.73 v62.61,12.06
MODEA  (via drill 0.35)
  Top 0.203: R50.1 24.85,63.03 22.35,65.53 MODE.1 | v64.01,14.35 65.79,12.57 68.97,12.57 IC1.61
  Bottom 0.203: MODE.1 20.32,63.88 23.24,60.96 24.51,59.69 24.51,57.53 32.13,49.91 32.13,44.96 34.8,42.29 37.59,42.29 46.23,33.66 46.23,25.02 47.5,23.75 52.2,23.75 61.6,14.35 v64.01,14.35
MODEB  (via drill 0.35)
  Top 0.203: MODE.3 21.08,56.13 23.07,57.95 R51.1 | v63.25,13.21 64.39,12.06 69.17,12.06 IC1.62
  Bottom 0.203: MODE.3 21.34,55.12 25.91,55.12 31.62,49.53 31.62,44.7 34.54,41.78 37.34,41.78 45.72,33.4 45.72,24.89 47.24,23.24 52.07,23.24 62.1,13.21 v63.25,13.21
N$1
  Top 0.203: IC1.12 85.33,7.55 C1.+
N$2
  Top 0.203: POT0.P$2 152.4,52.45 153.67,51.18 156.21,51.18 157.23,50.16 R3.1
N$3
  Top 0.203: POT1.P$2 39.62,75.06 38.86,74.3 36.07,74.3 35.31,73.53 R4.1
N$4
  Top 0.203: POT2.P$2 88.39,52.58 89.03,51.94 90.55,51.94 91.44,51.05 R5.1
N$5  (via drill 0.35)
  Top 0.203: R6.1 72.39,58.8 71.63,58.04 71.63,57.28 70.99,56.64 v65.15,56.64
  Bottom 0.203: POT3.P$2 64.01,55.24 v65.15,56.64
N$6
  Top 0.203: POT4.P$2 38.1,52.32 R7.1
N$7
  Top 0.203: POT5.P$2 87.54,30.27 R8.1
N$8
  Top 0.203: POT6.P$2 62.23,32.89 59.94,32.89 58.76,31.71 R9.1
N$9
  Top 0.203: POT7.P$2 39.62,30.35 38.73,29.46 38.77,29.43 R10.1
N$10
  Top 0.203: POT8.P$2 64.01,75.44 68.36,71.08 R11.1
N$11
  Top 0.203: POT9.P$2 88.9,76.07 88.9,74.04 90.59,72.35 R12.1
N$12  (via drill 0.35)
  Top 0.203: Q1.3 v4.95,44.83
  Bottom 0.203: v4.95,44.83 5.93,45.69 D1.C
N$13  (via drill 0.35)
  Top 0.203: v6.73,49.15 R18.1
  Bottom 0.203: D1.A v6.73,49.15
N$14
  Top 0.203: Q2.1 9.84,41.46 8.93,42.38 R21.1
N$15  (via drill 0.35)
  Top 0.203: v10.8,44.07 Q2.3
  Bottom 0.203: D2.C 11.3,44.54 10.83,44.07 v10.8,44.07
N$16  (via drill 0.35)
  Top 0.203: R20.1 v11.3,49.15
  Bottom 0.203: v11.3,49.15 D2.A
N$17
  Top 0.203: Q1.1 4,41.46 3.09,42.38 R19.1
N$18
  Top 0.203: Q3.1 15.43,41.59 14.61,42.42 13.68,42.42 R23.1
N$19  (via drill 0.35)
  Top 0.203: v15.88,44.2 16.38,43.69 Q3.3
  Bottom 0.203: D3.C 15.91,45.43 15.88,45.21 v15.88,44.2
N$20  (via drill 0.35)
  Top 0.203: R22.1 v15.88,49.15
  Bottom 0.203: v15.88,49.15 D3.A
N$21
  Top 0.203: Q4.1 21.15,41.46 20.11,42.51 R25.1
N$22  (via drill 0.35)
  Top 0.203: v22.1,45.09 Q4.3
  Bottom 0.203: D4.C 21.5,45.69 v22.1,45.09
N$23  (via drill 0.35)
  Top 0.203: R24.1 v20.45,49.15
  Bottom 0.203: v20.45,49.15 D4.A
N$24
  Top 0.203: Q5.1 26.86,41.34 25.91,42.29 25.11,42.29 R27.1
N$25  (via drill 0.35)
  Top 0.203: v27.81,44.96 Q5.3
  Bottom 0.203: D5.C 27.09,45.69 v27.81,44.96
N$26  (via drill 0.35)
  Top 0.203: R26.1 v25.02,49.15
  Bottom 0.203: v25.02,49.15 D5.A
N$27
  Top 0.203: R29.1 42.55,7.83 Q6.1
N$28  (via drill 0.35)
  Top 0.203: Q6.3 38.61,4.02 38.14,3.56 v36.45,3.56
  Bottom 0.203: D6.C 34.29,3.94 34.67,3.56 v36.45,3.56
N$29  (via drill 0.35)
  Top 0.203: v34.29,11.05 R28.1
  Bottom 0.203: D6.A v34.29,11.05
N$30
  Top 0.203: R31.1 119.48,6.41 Q7.1
N$31  (via drill 0.35)
  Top 0.203: Q7.3 124.33,5.33 124.33,4.15 124.92,3.56 v126.36,3.56
  Bottom 0.203: v126.36,3.56 127.8,3.56 128.27,4.06 D7.C
N$32  (via drill 0.35)
  Top 0.203: v128.27,10.54 R30.1
  Bottom 0.203: D7.A v128.27,10.54
N$33
  Top 0.203: Q8.1 133.67,28.36 R33.1
N$34  (via drill 0.35)
  Top 0.203: Q8.3 134.75,32.77 v135.51,33.53
  Bottom 0.203: v135.51,33.53 137.16,35.18 137.16,36.7 137.45,36.99 D8.C
N$35  (via drill 0.35)
  Top 0.203: R32.1 v138.43,33.4
  Bottom 0.203: v138.43,33.4 D8.A
N$36
  Top 0.203: Q9.1 132.73,47.33 R35.1
N$37  (via drill 0.35)
  Top 0.203: v136.65,43.94 136.65,45.59 135.89,46.35 Q9.3
  Bottom 0.203: D9.C 136.65,43.85 v136.65,43.94
N$38  (via drill 0.35)
  Top 0.203: v140.21,42.8 138.43,44.58 R34.1
  Bottom 0.203: D9.A 139.67,39.97 140.21,40.51 v140.21,42.8
N$39
  Top 0.203: Q10.1 132.48,91.4 R37.1
N$40  (via drill 0.35)
  Top 0.203: Q10.3 137.41,90.3 v138.43,89.28
  Bottom 0.203: v138.43,89.28 D10.C
N$41  (via drill 0.35)
  Top 0.203: v137.16,82.93 R36.1
  Bottom 0.203: D10.A 138.43,83.44 137.92,82.93 v137.16,82.93
N$42
  Top 0.203: Q11.1 130.87,77.28 130.14,77.81 R39.1
N$43  (via drill 0.35)
  Top 0.203: Q11.3 136.02,76.33 136.4,76.71 v136.4,78.23
  Bottom 0.203: v136.4,78.23 137.16,78.99 137.16,81.03 137.58,81.44 D11.C
N$44  (via drill 0.35)
  Top 0.203: v138.43,77.85 R38.1
  Bottom 0.203: D11.A v138.43,77.85
N$45
  Top 0.203: Q12.1 132.52,69.02 132.17,68.67 R41.1
N$46  (via drill 0.35)
  Top 0.203: v133.99,62.74 133.99,65.15 134.49,65.66 135.38,65.66 136.02,66.29 136.02,68.03 Q12.3
  Bottom 0.203: D12.C 135.03,61.56 133.99,62.61 v133.99,62.74
N$47  (via drill 0.35)
  Top 0.203: R40.1 v138.43,65.15
  Bottom 0.203: v138.43,65.15 D12.A
N$48
  Top 0.203: Q13.1 136.33,51.88 135.76,51.31 135.76,50.16 135.25,49.66 R43.1
N$49  (via drill 0.35)
  Top 0.203: v139.7,53.72 139.7,51.35 Q13.3
  Bottom 0.203: D13.C 138.43,54.99 v139.7,53.72
N$50  (via drill 0.35)
  Top 0.203: v137.03,54.23 135,52.2 R42.1
  Bottom 0.203: v137.03,54.23 137.03,58.17 137.45,58.58 D13.A
N$51  (via drill 0.35)
  Top 0.203: R44.1 v151.77,44.7
  Bottom 0.203: v151.77,44.7 152.78,43.69 155.19,43.69 156.34,42.55 D14.AR
N$52  (via drill 0.35)
  Top 0.203: R45.1 154.43,45.21 155.32,44.32 v156.46,44.32
  Bottom 0.203: D14.AB 157.44,43.35 v156.46,44.32
N$53  (via drill 0.35)
  Top 0.203: Q14.3 151.47,32.47 152.4,33.4 v154.94,33.4
  Bottom 0.203: v154.94,33.4 156.34,34.8 D14.CR
N$54  (via drill 0.35)
  Top 0.203: v158.75,34.67 158.96,34.46 Q15.3
  Bottom 0.203: D14.CB 157.44,35.98 v158.75,34.67
N$55
  Top 0.203: IC2.5 113.66,89.03 113.03,89.66 105.79,89.66 104.14,88.01 R53.1
N$56
  Top 0.203: Q14.1 146.46,29.91 R46.2
N$57
  Top 0.203: IC3.10 111.12,52.36 SW2.1 110.03,49.91 106.68,49.91 104.52,52.07 R63.2
N$58
  Top 0.203: Q15.1 154.21,29.78 R47.2
N$59
  Top 0.203: SW2.2 112.39,53.59 IC3.11 112.39,59.18 112.27,59.31 105.54,59.31 103.76,57.53 R64.2
N$60
  Top 0.203: SW2.3 113.66,54.82 113.66,57.53 IC3.12 113.66,59.44 113.03,60.07 R65.2
N$61
  Top 0.203: SW2.4 118.88,51.68 114.93,55.63 114.93,57.53 IC3.13 114.93,59.44 116.84,61.34 118.66,61.34 R66.2
N$62
  Top 0.203: IC2.10 111.12,75.09 SW1.1 111.8,74.08 110.49,72.77 106.68,72.77 104.14,75.31 R54.2
N$63
  Top 0.203: SW1.2 112.39,76.32 IC2.11 112.39,81.79 112.14,82.04 106.55,82.04 104.9,80.39 R55.2
N$64
  Top 0.203: SW1.3 113.66,77.55 113.66,80.39 IC2.12 113.66,82.3 113.03,82.93 R56.2
N$65
  Top 0.203: IC2.13 114.93,77.51 115.86,76.58 118.11,76.58 119.25,75.44 119.25,75.18 SW1.4 119.3,74.12 120.65,72.77 R57.2
N$66
  Top 0.203: IC2.1 118.74,92.16 SW1.5 120.3,92.72 R58.2
N$67
  Top 0.203: IC2.2 117.47,92.04 SW1.6 118.44,94.36 R59.2
N$68
  Top 0.203: R60.2 104.14,93.09 105.41,94.36 113.03,94.36 114.3,93.09 SW1.7 116.2,90.81 IC2.3
N$69
  Top 0.203: R61.2 110.49,90.55 111.8,91.86 SW1.8 114.93,89.58 IC2.4
N$70
  Top 0.203: IC3.1 118.74,69.43 SW2.5 119.55,69.68 121.54,67.69 R67.2
N$71
  Top 0.203: R2.1 76.09,24.52 76.96,23.62 76.96,13.8 IC1.9
N$72
  Top 0.203: IC3.2 117.47,69.31 SW2.6 116.8,70.19 116.84,71.37 117.47,71.88 119.76,71.88 121.41,70.23 R68.2
N$73
  Top 0.203: R69.2 105.41,72.77 106.68,71.5 113.03,71.5 114.3,70.23 SW2.7 116.2,68.08 IC3.3
N$74
  Top 0.203: IC3.4 114.93,66.85 SW2.8 111.8,69 110.74,67.94 107.95,67.94 107.53,67.94 106.68,67.94 104.39,70.23 R70.2
N$75
  Top 0.203: IC3.5 113.66,66.42 113.03,67.06 104.9,67.06 104.27,66.42 R62.1
N$76
  Top 0.203: IC4.10 111.12,29.75 111.52,29.35 111.76,29.12 | 111.76,29.12 SW3.1 | R72.2 111.76,29.12
N$77
  Top 0.203: IC4.11 112.39,32.64 114.3,30.73 SW3.2 R73.2
N$78
  Top 0.203: IC4.12 113.66,32.77 116.8,29.63 SW3.3 116.71,28.99 R74.2
N$79
  Top 0.203: IC4.13 114.93,33.02 116.33,31.62 118.49,31.62 119.25,30.86 119.25,29.12 | 119.25,29.12 SW3.4 | R75.2 119.25,29.12
N$80
  Top 0.203: IC4.1 118.74,44.7 119.3,45.26 SW3.5 R76.2
N$81
  Top 0.203: IC4.2 117.47,46.7 SW3.6 119.33,49.91 121.92,49.91 122.34,50.33 R77.2
N$82
  Top 0.203: R78.2 112.53,49.15 SW3.7 116.2,45.47 IC4.3
N$83
  Top 0.203: R79.2 104.9,46.61 106.68,44.83 110.49,44.83 111.8,46.14 SW3.8 111.8,47.33 114.93,44.2 IC4.4
N$84
  Top 0.203: R71.1 104.14,43.94 104.39,44.2 112.78,44.2 113.66,43.31 IC4.5
PGC
  Top 0.203: PROG.5 64.97,16.38 67.31,16.38 70.36,19.43 71.33,19.43 | 71.33,19.43 | IC1.52 71.33,19.43
PGD
  Top 0.203: PROG.4 64.64,20.32 64.9,20.07 65.66,20.07 69.34,23.75 70.55,23.75 IC1.47
SCL1
  Top 0.203: IC1.44 73.66,22.76 73.66,42.29 72.26,43.69 IC5.6 66.67,43.69 65.79,42.8 65.79,41.78 65.02,41.02 61.34,41.02 59.69,42.67 59.69,45.97 57.28,48.39 51.31,48.39 50.29,47.37 R81.1 49.24,45.05 48.64,44.45 48.64,41.78 SCL1.1
SCL2
  Top 0.203: IC1.64 69.57,11.05 62.36,11.05 51.69,21.72 51.69,33.15 SCL2.1
SDA1
  Top 0.203: IC1.45 72.52,23.19 72.52,42.16 72.26,42.42 IC5.5 68.89,42.29 67.31,42.29 66.93,41.91 66.93,41.27 65.79,40.13 60.07,40.13 56.8,43.41 R82.1 55.41,37.81 55.37,37.72 SDA1.1
SDA2
  Top 0.203: IC1.65 69.77,10.54 61.34,10.54 50.55,21.34 50.55,34.29 SDA2.1
SW1  (via drill 0.35)
  Top 0.203: R13.1 128.52,81.66 129.87,80.31 S1.3 | v92.46,3.43 91.19,2.16 86.48,2.16 IC1.6
  Bottom 0.203: S1.3 131.09,71.22 132.72,69.6 132.72,60.96 133.48,60.2 142.49,60.2 147.32,55.5 147.32,48.64 150.37,45.59 150.37,24.89 148.08,22.61 130.81,22.61 129.54,21.34 129.54,18.8 128.91,18.16 127,18.16 126.49,17.65 126.49,9.4 125.48,8.38 118.74,8.38 113.79,3.43 v92.46,3.43
SW2  (via drill 0.35)
  Top 0.203: v147.96,24.51 146.69,23.24 130.3,23.24 113.54,6.48 94.23,6.48 90.42,2.67 86.68,2.67 IC1.7 | R14.1 132.5,57.11 132.16,57.45 S2.3
  Bottom 0.203: S2.3 131.09,57.43 131.06,57.02 131.06,49.02 131.7,48.39 136.02,48.39 136.4,48.77 145.29,48.77 149.61,44.58 149.61,33.53 147.96,31.88 v147.96,24.51
SW3  (via drill 0.35)
  Top 0.203: 131.01,35.94 S3.3 132.5,37.27 R15.1 | v77.47,11.81 77.4,11.81 IC1.74
  Bottom 0.203: S3.3 125.81,35.87 124.46,37.21 107.95,37.21 106.68,35.94 106.68,26.8 92.84,12.7 91.82,12.7 89.66,14.86 80.52,14.86 v77.47,11.81
SW4  (via drill 0.35)
  Top 0.203: S4.3 22.24,32.47 R16.1 | IC1.69 70.44,8.38 67.56,8.38 64.64,5.46 46.61,5.46 44.96,3.81 v42.42,3.81
  Bottom 0.203: S4.3 24.99,23.5 34.66,23.5 35.3,22.86 41.02,17.06 41.02,5.21 v42.42,3.81
SW5
  Top 0.203: S5.3 147.57,35.84 147.57,33.66 144.4,30.48 144.4,28.96 143.68,28.23 R17.1 142.49,24.77 141.99,24.26 130.18,24.26 113.03,7.24 94.11,7.24 90.02,3.15 86.9,3.15 IC1.8
TAILS  (via drill 0.35)
  Top 0.203: IC1.53 71.13,18.92 70.87,18.92 67.56,15.62 v66.8,15.62 | TAILS.1 57.4,34.67 v58.8,33.27
  Bottom 0.203: v58.8,33.27 59.69,32.38 59.69,29.59 63.5,25.78 63.5,23.24 65.53,21.21 65.53,18.54 66.55,17.53 66.55,15.88 v66.8,15.62
VDD  (via drill 0.35)
  Top 0.203: 72.75,20.84 C8.1 | R13.2 129.96,85.94 130.94,84.96 130.94,83.69 131.7,82.93 R36.2 132.63,84.11 133.86,85.34 139.83,85.34 | IC2.16 118.74,79.12 v119.38,78.49 120.9,78.49 123.06,80.64 C11.2 124.33,81.15 124.33,85.72 126.36,87.76 126.36,92.71 127.89,94.23 138.94,94.23 140.08,93.09 140.08,85.6 | C10.2 120.65,59.56 119.38,59.56 118.74,58.93 IC3.16 | R32.2 139.61,28.23 140.34,28.96 140.34,29.72 | 85.69,17.27 88.37,17.27 C4.1 | 85.69,17.27 | IC1.32 83.38,21.33 C2.1 | R45.2 R44.2 | R44.2 151.77,49.28 151.13,49.91 | 151,50.04 151.13,49.91 | 151.13,49.91 149.86,51.27 POT0.P$3 | POT6.P$3 61.47,29.15 R1.2 64.84,25.78 66.35,25.78 PROG.2 70.51,24.66 71.5,25.65 71.5,31.5 71.12,31.88 v71.12,39.75 | POT1.P$3 34.29,76.58 31.75,74.04 31.75,70.74 26.67,65.66 R50.2 | 140.08,85.09 140.08,75.18 139.36,74.46 R38.2 R40.2 148.3,68.67 149.86,67.11 POT0.P$3 | 140.08,85.09 140.08,85.34 | 140.08,85.34 139.95,85.34 | 140.08,85.34 140.08,85.47 | 140.08,85.47 140.08,85.6 | 139.83,85.34 140.08,85.09 | 140.08,85.47 139.95,85.34 | 139.95,85.34 139.83,85.34 | 139.83,85.34 140.08,85.6 | R53.2 91.44,88.01 v90.17,86.74 67.31,86.74 61.47,80.9 POT8.P$3 C6.+ 61.47,69.09 60.2,67.82 53.59,67.82 51.18,70.23 IC6.2 | R15.2 134.24,39.24 | 134.24,39.24 135.76,39.24 136.53,38.48 140.08,38.48 | 140.08,38.48 140.34,38.48 | 142.37,46.23 141.22,47.37 138.34,47.37 R34.2 | R44.2 148.81,48.22 146.81,46.23 142.62,46.23 | 142.62,46.23 142.49,46.23 | 142.49,46.23 142.37,46.23 | 142.37,46.23 142.37,46.1 | 142.37,46.1 142.37,45.97 | 142.37,45.97 142.37,39.5 141.35,38.48 140.59,38.48 | 142.37,46.1 142.49,46.23 | 142.62,46.23 142.37,45.97 | 140.34,38.23 140.34,38.48
  Top 0.203: 140.34,38.48 140.59,38.48 | 140.59,38.48 140.34,38.23 | 140.08,38.48 140.34,38.23 | SW2.C 107.45,51.68 105.41,53.72 99.06,53.72 98.81,53.47 98.81,44.2 99.06,43.94 R71.2 | v128.91,53.72 130.56,52.2 R42.2 132.5,53.25 132.84,53.59 133.99,53.59 134.2,53.81 R14.2 135.64,54.99 136.02,55.37 143.38,55.37 145.03,53.72 POT0.P$3 | v133.6,36.96 133.6,37.34 134.24,37.97 134.24,39.24 | 140.34,29.72 140.34,29.97 | 140.34,29.97 140.34,30.23 | 140.34,30.23 140.34,38.23 | R17.2 142.46,29.97 140.59,29.97 | 140.34,29.97 140.59,29.97 | 140.59,29.97 140.34,30.23 | 140.59,29.97 140.34,29.72 | v123.19,25.78 123.19,28.83 v119.13,32.89 | R30.2 v128.27,19.43 | IC4.16 118.74,36.45 119,36.7 122.17,36.7 C12.2 | R62.2 97.79,66.42 94.61,69.6 v94.61,74.42 | R48.2 R28.2 v34.29,26.67 | C5.1 70.24,6.77 IC1.71 74.93,11.46 74.93,18.66 | R52.2 5.29,57.11 4.45,56.26 4.45,53.09 5.25,52.29 R18.2 R20.2 R22.2 R24.2 R26.2 27.14,52.29 v29.21,54.36 29.21,58.8 28.36,59.65 R51.2 | C23.1 67.69,46.35 67.82,46.23 IC5.8 | v57.15,45.59 56.64,45.09 55.43,45.09 | 55.43,45.09 R82.2 | 74.93,18.66 | POT2.P$3 85.85,63.12 83.82,65.15 83.82,74.55 POT9.P$3 | 72.75,20.84 IC1.48 74.93,18.66 | 72.75,20.84 | IC1.25 85.92,18.91 C3.1 | IC1.23 85.69,17.27 | v54.61,56.26 39.5,56.26 POT4.P$3 36.32,53.09 36.32,46.1 37.08,45.34 POT7.P$3 26.92,31.12 26.58,30.77 R16.2 | R81.2 51.86,43.35 53.59,45.09 55.43,45.09 | R49.2 73.95,3.05 v71.75,3.05
  Bottom 0.203: v119.38,78.49 118.87,77.98 110.49,77.98 109.3,76.79 SW1.C 106.63,77.09 97.28,77.09 v94.61,74.42 88.01,74.42 POT9.P$3 85.85,79.63 90.17,83.95 v90.17,86.74 | SW2.C 109.22,51.76 109.22,54.99 110.11,55.88 123.32,55.88 C10.2 123.82,54.48 124.59,53.72 v128.91,53.72 | POT8.P$3 61.47,76.96 58.42,80.01 38.1,80.01 37.08,78.99 POT1.P$3 POT4.P$3 29.72,53.85 v29.21,54.36 | SW3.C 109.3,30.31 109.85,30.86 113.66,30.86 115.7,32.89 v119.13,32.89 121.79,35.56 C12.2 124.46,34.42 132.46,34.42 133.6,35.56 v133.6,36.96 | v128.27,19.43 123.19,24.51 v123.19,25.78 | 61.47,51.44 POT3.P$3 61.47,54.48 59.69,56.26 v54.61,56.26 | 61.47,51.44 61.47,51.18 | 61.47,51.18 61.72,51.18 | 61.72,51.18 66.8,51.18 67.69,50.29 C23.1 70.74,49.02 71.12,48.64 v71.12,39.75 | 61.47,51.18 57.15,46.86 v57.15,45.59 | 61.72,51.18 61.47,51.44 | POT6.P$3 63.75,33.4 76.2,33.4 78.49,31.12 POT5.P$3 83.94,29.2 C2.1 86.35,18.91 C3.1 C4.1 | C8.1 69.22,22.91 PROG.2 | v34.29,26.67 34.29,28.32 POT7.P$3 | v71.75,3.05 69.73,5.07 C5.1
VIN
  Top 0.508: DC1.S 49.53,88.9 DC1.R 48.9,83.57 45.72,80.39 R80.2
VINF
  Top 0.508: R80.1 47.16,76.75 48.26,77.85 50.52,77.85 T2.1 51.03,77.85 53.34,77.85 C9.+
VSS
  pour Top: -2.54,18.16 -2.54,104.52 171.45,104.52 171.45,-3.43 25.4,-3.43 25.4,18.16
  pour Bottom: -2.54,104.52 168.91,104.52 168.91,-3.43 -5.08,-3.43 -5.08,104.52

### Text on the board
tPlace: Date / Serial:
tNames: (c) T.Grubb 2018 | PITCH DELAY | Control Board v1.1